# Altium project KlusterLab r2.0.PrjPcb (part 9 of 10)

## Sheet PSU_VCC5V_Buck.SchDoc
size A3; SheetNumber: 3; SheetTotal: 32
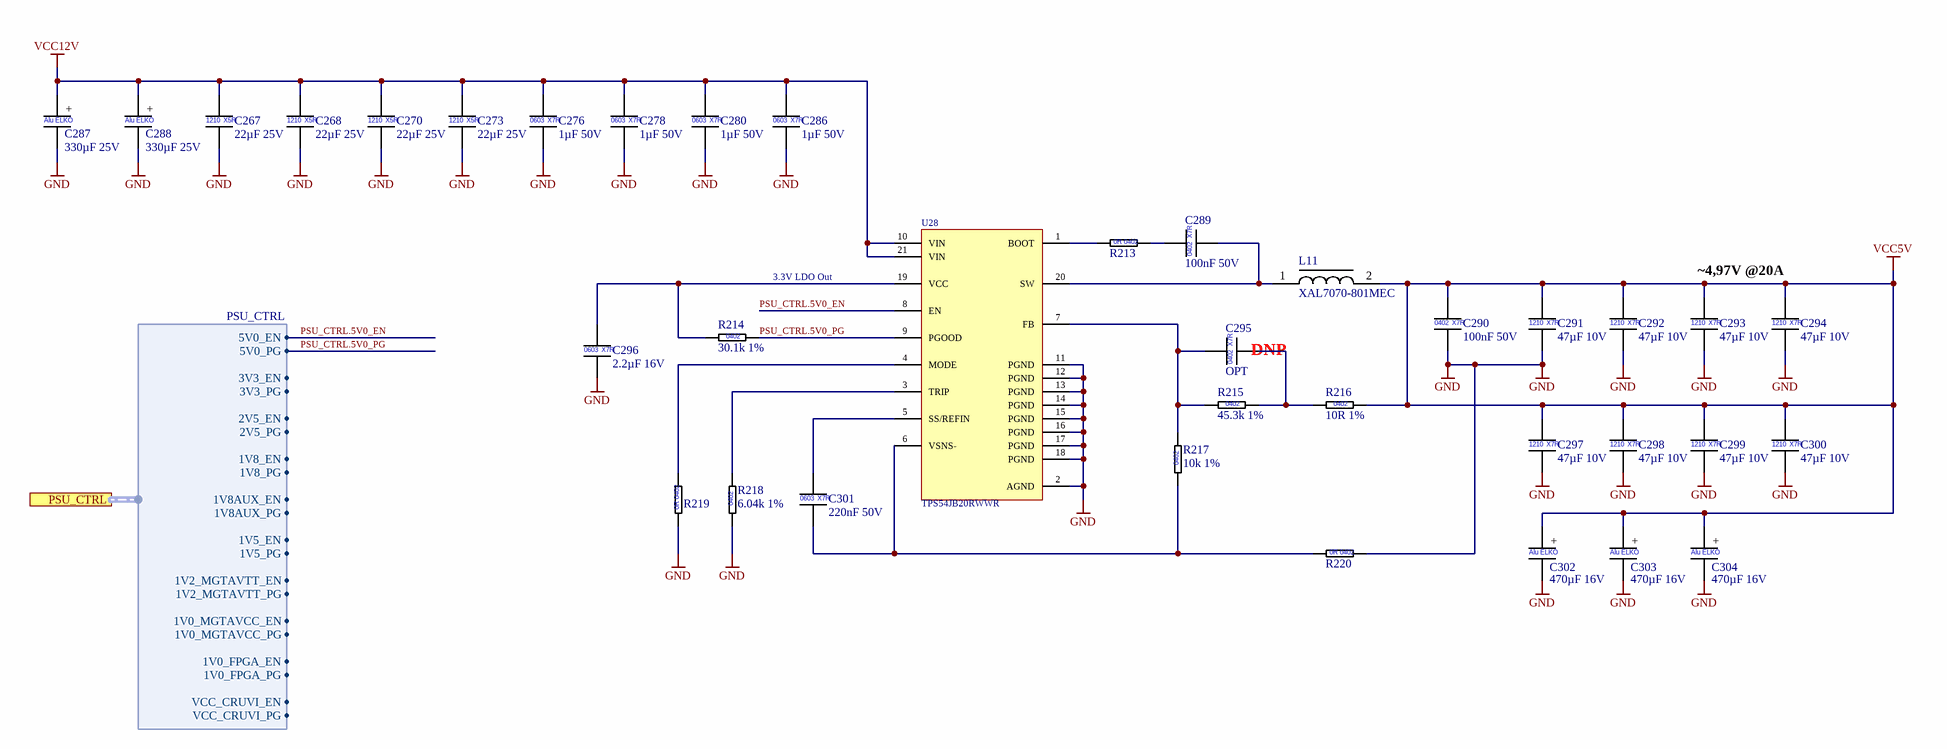
[diagram p26: PSU_VCC5V_Buck.SchDoc]

### Parts
C267  22µF 25V  [CAP_1210]
C268  22µF 25V  [CAP_1210]
C270  22µF 25V  [CAP_1210]
C273  22µF 25V  [CAP_1210]
C276  1µF 50V  [CAP_0603]
C278  1µF 50V  [CAP_0603]
C280  1µF 50V  [CAP_0603]
C286  1µF 50V  [CAP_0603]
C287  330µF 25V  [WCAP-PTG5_D10H12.5]
C288  330µF 25V  [WCAP-PTG5_D10H12.5]
C289  100nF 50V  [CAP_0402]
C290  100nF 50V  [CAP_0402]
C291  47µF 10V  [CAP_1210]
C292  47µF 10V  [CAP_1210]
C293  47µF 10V  [CAP_1210]
C294  47µF 10V  [CAP_1210]
C295  OPT  [CAP_0402]  (no BOM)
C296  2.2µF 16V  [CAP_0603]
C297  47µF 10V  [CAP_1210]
C298  47µF 10V  [CAP_1210]
C299  47µF 10V  [CAP_1210]
C300  47µF 10V  [CAP_1210]
C301  220nF 50V  [CAP_0603]
C302  470µF 16V  [WCAP-PTG5_D8H13]
C303  470µF 16V  [WCAP-PTG5_D8H13]
C304  470µF 16V  [WCAP-PTG5_D8H13]
L11  XAL7070-801MEC  [COILCRAFT_XAL7070]
R213  0R Jumper  [RES_0402]  (value not drawn)
R214  30.1k 1%  [RES_0402]
R215  45.3k 1%  [RES_0402]
R216  10R 1%  [RES_0402]
R217  10k 1%  [RES_0402]
R218  6.04k 1%  [RES_0402]
R219  0R Jumper  [RES_0402]  (value not drawn)
R220  0R Jumper  [RES_0402]  (value not drawn)
U28  TPS54JB20RWWR  [VQFN-HR21_RWW0021A]

### Ports
PSU_CTRL (harness PSU_CTRL, see Power-Tree[2B], PSU_MGTAVCC_Buck[1B], PSU_MGTAVTT_Buck[1B], PSU_VCC1V0_FPGA_Buck[1B], PSU_VCC1V5_Buck[1B], PSU_VCC1V8_Buck[1B], PSU_VCC1V8AUX_Buck[1B], PSU_VCC2V5_Buck[1B], PSU_VCC3V3_Buck[1B], PSU_VCC_CRUVI_ADJ_Buck[1B])

### Harnesses
PSU_CTRL: 5V0_EN, 5V0_PG, 3V3_EN, 3V3_PG, 2V5_EN, 2V5_PG, 1V8_EN, 1V8_PG, 1V8AUX_EN, 1V8AUX_PG, 1V5_EN, 1V5_PG, 1V2_MGTAVTT_EN, 1V2_MGTAVTT_PG, 1V0_MGTAVCC_EN, 1V0_MGTAVCC_PG, 1V0_FPGA_EN, 1V0_FPGA_PG, VCC_CRUVI_EN, VCC_CRUVI_PG

### Nets
GND: C267.2 C268.2 C270.2 C273.2 C276.2 C278.2 C280.2 C286.2 C287.2 C288.2 C290.2 C291.2 C292.2 C293.2 C294.2 C296.2 C297.2 C298.2 C299.2 C300.2 C302.2 C303.2 C304.2 R218.1 R219.1 R220.2 U28.2(AGND) U28.11(PGND) U28.12(PGND) U28.13(PGND) U28.14(PGND) U28.15(PGND) U28.16(PGND) U28.17(PGND) U28.18(PGND)
VCC5V: C290.1 C291.1 C292.1 C293.1 C294.1 C297.1 C298.1 C299.1 C300.1 C302.1 C303.1 C304.1 L11.2 R216.2
VCC12V: C267.1 C268.1 C270.1 C273.1 C276.1 C278.1 C280.1 C286.1 C287.1 C288.1 U28.10(VIN) U28.21(VIN)
PSU_CTRL.5V0_EN: U28.8(EN) ; port PSU_CTRL.5V0_EN
PSU_CTRL.5V0_PG: R214.2 U28.9(PGOOD) ; port PSU_CTRL.5V0_PG
NetC289_1: C289.1 R213.2
NetC289_2: C289.2 L11.1 U28.20(SW)
NetC295_1: C295.1 R215.1 R217.2 U28.7(FB)
NetC295_2: C295.2 R215.2 R216.1
NetC296_1: C296.1 R214.1 U28.19(VCC)
NetC301_1: C301.1 U28.5(SS/REFIN)
NetC301_2: C301.2 R217.1 R220.1 U28.6(VSNS-)
NetR213_1: R213.1 U28.1(BOOT)
NetR218_2: R218.2 U28.3(TRIP)
NetR219_2: R219.2 U28.4(MODE)

### Notes on the sheet
- 3.3V LDO Out
- (near C294) ~4,97V @20A
- (near C295) DNP
- Company:
- Contact:
- Customer:
- mail@pcb-arts.com
- PCB Arts GmbH
- Title:
- Project:
- The  information  contained  in  these  documents  is  confidential,  privileged  and  only  for  the information of the intended recipient and may not be used, published or redistributed Without the prior written consent from PCB Arts GmbH.
- Engineer:
- Document Number:
- Revision:
- Variant:
- Date:
- Time:
- Sheet:
- Status:
- /
- (in symbol CAP_0402_100nF_50V) X7R; 0402
- (in symbol CAP_0402_OPT) X7R; 0402
- (in symbol CAP_0603_1µF_50V_X7R_10%) 0603; X7R
- (in symbol CAP_0603_2.2µF_16V_X7R_10%) 0603; X7R
- (in symbol CAP_0603_220nF_50V_X7R_10%) 0603; X7R
- (in symbol CAP_1210_22µF_25V) 1210; X5R
- (in symbol CAP_1210_47µF_10V_X7R_10%) 1210; X7R
- (in symbol CAP_D8L9_470µF_16V) +; Alu ELKO
- (in symbol CAP_D10L12.5_330µF_25V) +; Alu ELKO
- (in symbol RES_0402_0R Jumper) 0R 0402
- (in symbol RES_0402_6.04k_1%) 0402
- (in symbol RES_0402_10k_1%) 0402
- (in symbol RES_0402_10R_1%) 0402
- (in symbol RES_0402_30.1k_1%) 0402
- (in symbol RES_0402_45.3k_1%) 0402

### Library data of the parts
C267 C268 C270 C273 = CAP_1210_22µF_25V: Multilayer Ceramic Capacitors MLCC - SMD/SMT 1210 25VDC; Manufacturer 1: KEMET; Manufacturer 1 Prt. Nr.: C1210C226K3PACTU; Manufacturer 2 Prt. Nr.: TMK212BBJ226MG-TT; Manufacturer 2: Taiyo Yuden
C276 C278 C280 C286 = CAP_0603_1µF_50V_X7R_10%: Multilayer Ceramic Capacitors MLCC - SMD/SMT 50V 1uF X7R 0603 10%; Manufacturer 1: KYOCERA AVX; Manufacturer 1 Prt. Nr.: 06035C105KAT2A; Manufacturer 2 Prt. Nr.: MSASU168AB7105KTNA01; Manufacturer 2: TAIYO YUDEN
C287 C288 = CAP_D10L12.5_330µF_25V: Organische Polymer-Aluminiumkondensatoren 330uF 25 Volts 20% AEC-Q200; Manufacturer 1: Würth Elektronik; Manufacturer 1 Prt. Nr.: 870025575009
C289 C290 = CAP_0402_100nF_50V: Multilayer Ceramic Capacitors MLCC - SMD/SMT 0402 50VDC; Manufacturer 1: Murata Electronics; Manufacturer 1 Prt. Nr.: GCM155L8EH104KE07D; Manufacturer 2 Prt. Nr.: UMK105B7104KV-FR; Manufacturer 2: TDK
C291-C294 C297-C300 = CAP_1210_47µF_10V_X7R_10%: Multilayer Ceramic Capacitors MLCC - SMD/SMT 47 uF 10 VDC 10% 1210 X7R; Manufacturer 1: Murata Electronics; Manufacturer 1 Prt. Nr.: GRM32ER71A476KE15L; Manufacturer 2 Prt. Nr.: C1210C106K8RACTU; Manufacturer 2: KEMET
C295 = CAP_0402_OPT: Multilayer Ceramic Capacitors MLCC - SMD/SMT 0402 Optional Placeholder
C296 = CAP_0603_2.2µF_16V_X7R_10%: Multilayer Ceramic Capacitors MLCC - SMD/SMT 2.2 uF 16 VDC 10% 0603 X7R; Manufacturer 1: Murata Electronics; Manufacturer 1 Prt. Nr.: GRM188Z71C225KE43D; Manufacturer 2 Prt. Nr.: EMK107BB7225KA-T; Manufacturer 2: TAIYO YUDEN
C301 = CAP_0603_220nF_50V_X7R_10%: Multilayer Ceramic Capacitors MLCC - SMD/SMT 0.22 uF 50 VDC 10% 0603 X7R; Manufacturer 1: Murata Electronics; Manufacturer 1 Prt. Nr.: GRJ188R71H224KE11D; Manufacturer 2 Prt. Nr.: CGA3E3X7R1H224K080AE; Manufacturer 2: TDK
C302-C304 = CAP_D8L9_470µF_16V: Organische Polymer-Aluminiumkondensatoren 470uF 16 Volts 20%; Manufacturer 1: Würth Elektronik; Manufacturer 1 Prt. Nr.: 870025374007
L11 = XAL7070-801MEC_Power Inductors SMD 800nH Shld 20% 25.8A 2.29mOhms AECQ200: Power Inductors - SMD 800nH Shld 20% 25.8A 2.29mOhms AECQ200; Manufacturer 1: Coilcraft; Manufacturer 1 Prt. Nr.: XAL7070-801MEC
R213 R219 R220 = RES_0402_0R Jumper: Thick Film Resistors - SMD 0Ohm; Manufacturer 1: Vishay / Dale; Manufacturer 1 Prt. Nr.: CRCW04020000Z0EDC; Manufacturer 2 Prt. Nr.: RC0402JR-070RL; Manufacturer 2: Yageo
R214 = RES_0402_30.1k_1%: Thick Film Resistors - SMD 30.1kOhm 1%; Manufacturer 1: Vishay / Dale; Manufacturer 1 Prt. Nr.: CRCW040230K1FKEDC; Manufacturer 2 Prt. Nr.: RC0402FR-1330K1L; Manufacturer 2: Yageo
R215 = RES_0402_45.3k_1%: Thick Film Resistors - SMD 45.3kOhm 1%; Manufacturer 1: Vishay / Dale; Manufacturer 1 Prt. Nr.: CRCW040245K3FKEDC; Manufacturer 2 Prt. Nr.: RC0402FR-0745K3L; Manufacturer 2: Yageo
R216 = RES_0402_10R_1%: Thick Film Resistors - SMD 10Ohm 1%; Manufacturer 1: Vishay / Dale; Manufacturer 1 Prt. Nr.: CRCW040210R0FKEE; Manufacturer 2 Prt. Nr.: RC0402FR-7W10RL; Manufacturer 2: Yageo
R217 = RES_0402_10k_1%: Thick Film Resistors - SMD 10kOhm 1%; Manufacturer 1: Vishay / Dale; Manufacturer 1 Prt. Nr.: CRCW040210K0FKEDC; Manufacturer 2 Prt. Nr.: RC0402FR-7W10KL; Manufacturer 2: Yageo
R218 = RES_0402_6.04k_1%: Thick Film Resistors - SMD 6.04kOhm 1%; Manufacturer 1: Vishay / Dale; Manufacturer 1 Prt. Nr.: CRCW04026K04FKEDC; Manufacturer 2 Prt. Nr.: RC0402FR-7W6K04L; Manufacturer 2: Yageo
U28 = TPS54JB20RWWR_Switching Voltage Regulators 2.7-V to 16-V input 20-A synchronous Buck: Switching Voltage Regulators 2.7-V to 16-V input 20-A synchronous Buck; Manufacturer 1: Texas Instruments; Manufacturer 1 Prt. Nr.: TPS54JB20RWWR

## Sheet PSU_VCC_CRUVI_ADJ_Buck.SchDoc
size A3; SheetNumber: 12; SheetTotal: 32
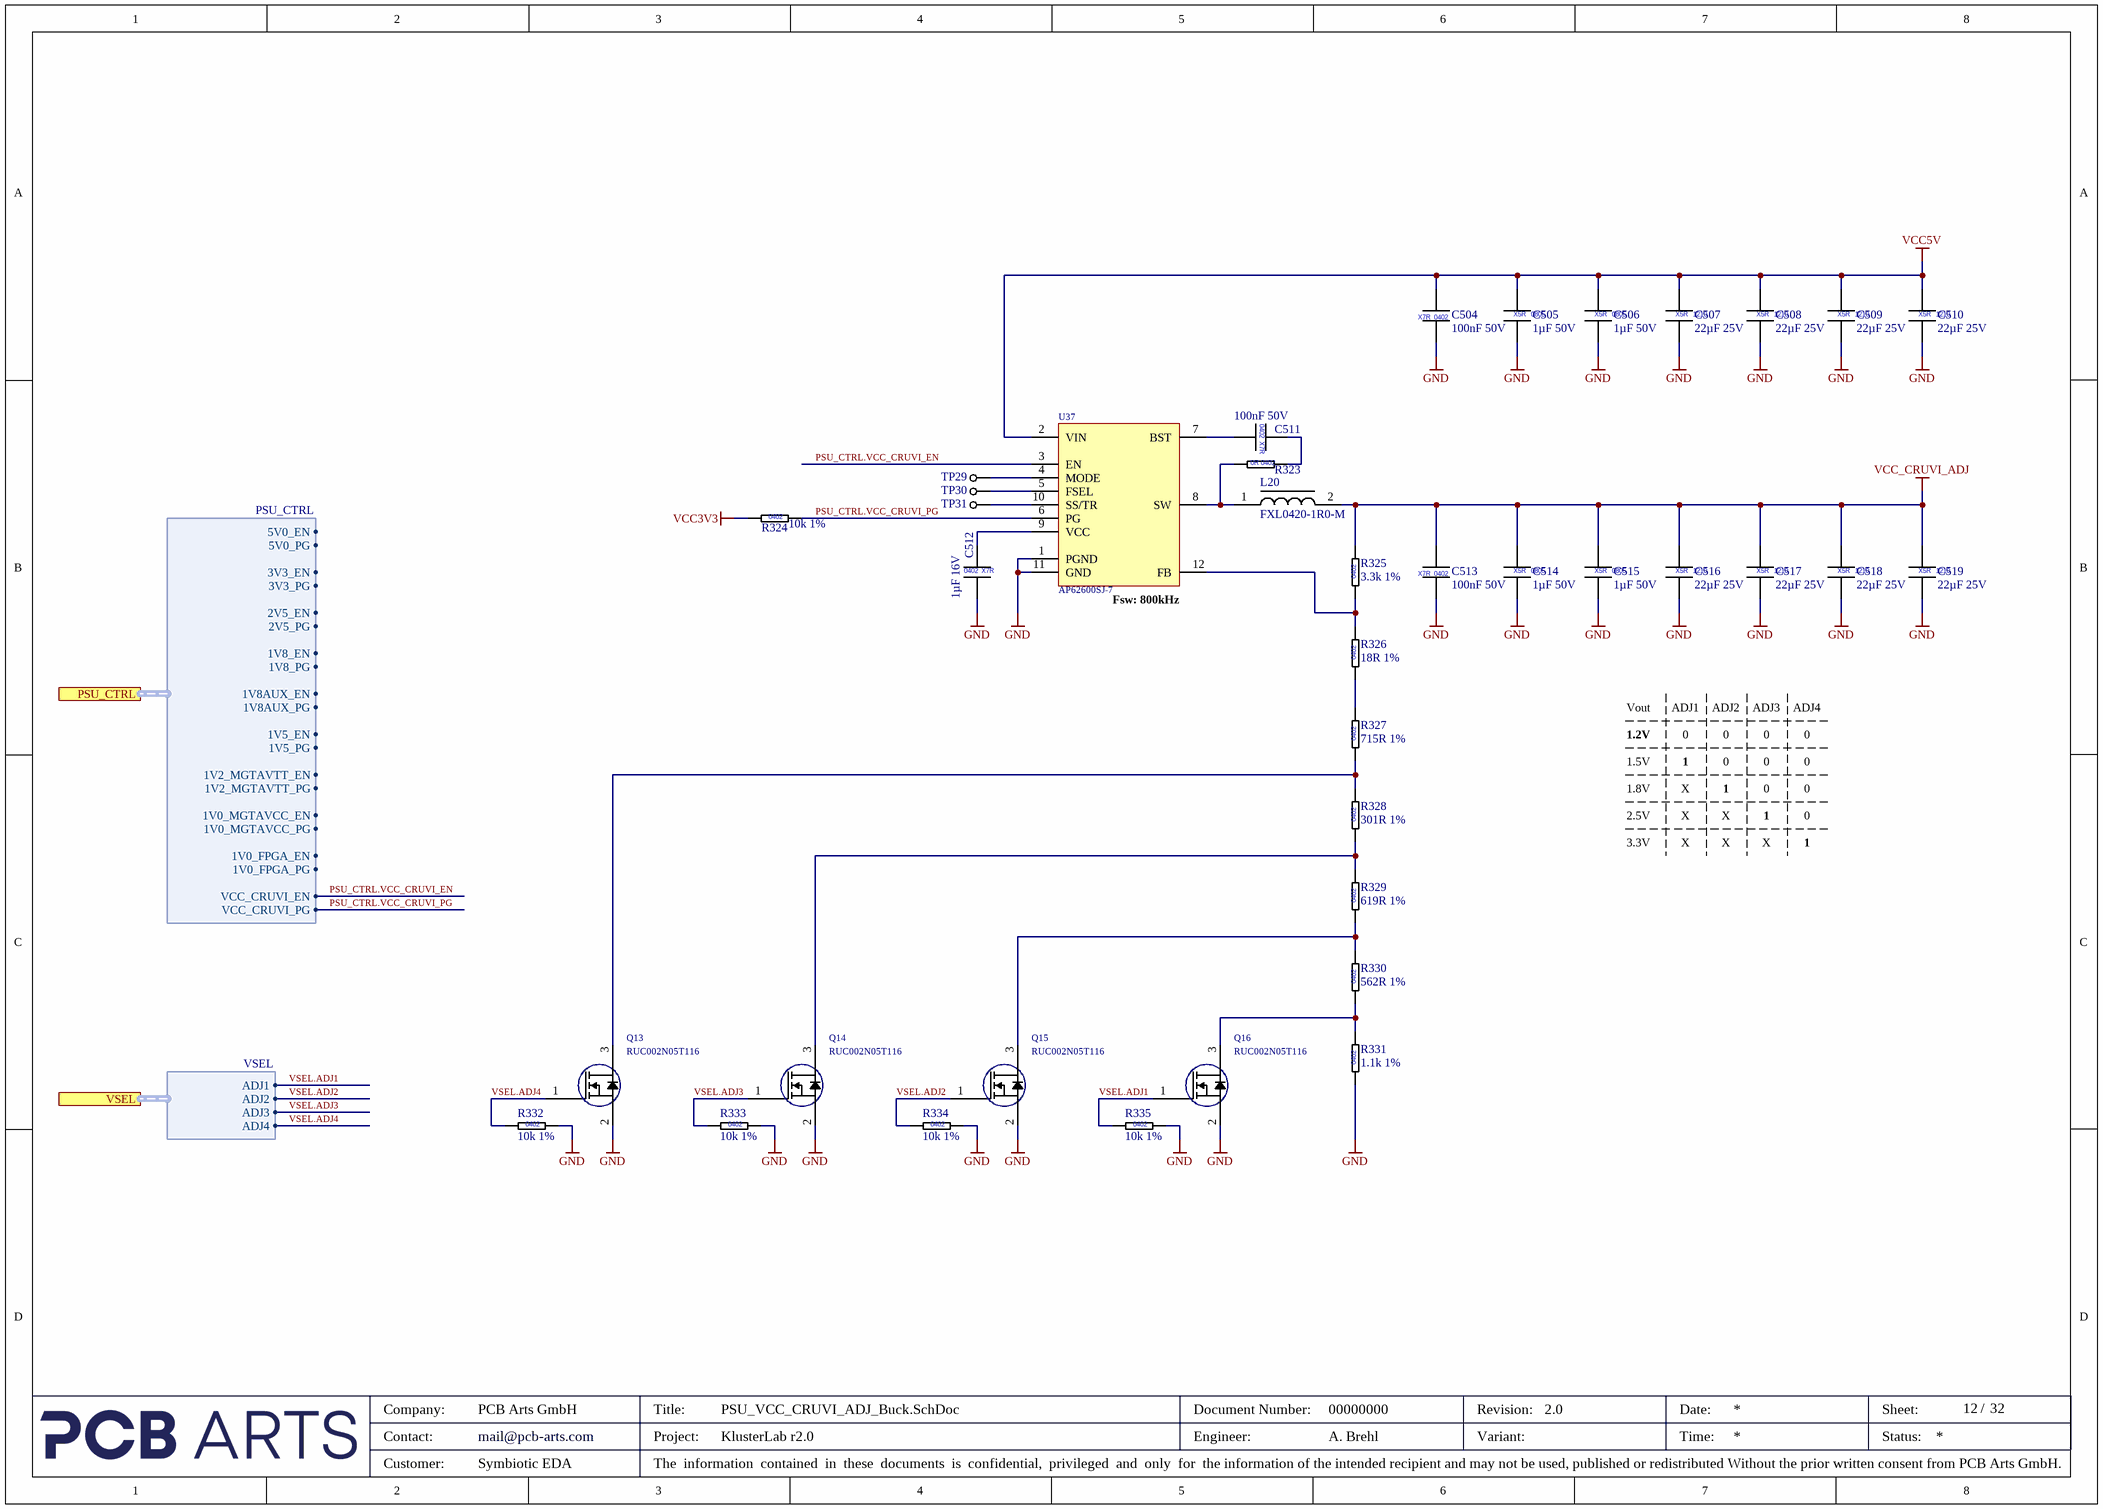
[diagram p27: PSU_VCC_CRUVI_ADJ_Buck.SchDoc]

### Parts
C504  100nF 50V  [CAP_0402_L]
C505  1µF 50V  [CAP_0805]
C506  1µF 50V  [CAP_0805]
C507  22µF 25V  [CAP_1210]
C508  22µF 25V  [CAP_1210]
C509  22µF 25V  [CAP_1210]
C510  22µF 25V  [CAP_1210]
C511  100nF 50V  [CAP_0402_L]
C512  1µF 16V  [CAP_0402_L]
C513  100nF 50V  [CAP_0402_L]
C514  1µF 50V  [CAP_0805]
C515  1µF 50V  [CAP_0805]
C516  22µF 25V  [CAP_1210]
C517  22µF 25V  [CAP_1210]
C518  22µF 25V  [CAP_1210]
C519  22µF 25V  [CAP_1210]
L20  FXL0420-1R0-M  [FXL0420-1R0-M]
Q13  RUC002N05T116  [SOT95P251X112-3N]
Q14  RUC002N05T116  [SOT95P251X112-3N]
Q15  RUC002N05T116  [SOT95P251X112-3N]
Q16  RUC002N05T116  [SOT95P251X112-3N]
R323  0R Jumper  [RES_0402_L]  (value not drawn)
R324  10k 1%  [RES_0402_L]
R325  3.3k 1%  [RES_0402_L]
R326  18R 1%  [RES_0402_L]
R327  715R 1%  [RES_0402_L]
R328  301R 1%  [RES_0402_L]
R329  619R 1%  [RES_0402_L]
R330  562R 1%  [RES_0402_L]
R331  1.1k 1%  [RES_0402_L]
R332  10k 1%  [RES_0402_L]
R333  10k 1%  [RES_0402_L]
R334  10k 1%  [RES_0402_L]
R335  10k 1%  [RES_0402_L]
TP29  Testpoint  [Testpoint 0.8mm]  (value not drawn)  (no BOM)
TP30  Testpoint  [Testpoint 0.8mm]  (value not drawn)  (no BOM)
TP31  Testpoint  [Testpoint 0.8mm]  (value not drawn)  (no BOM)
U37  AP62600SJ-7  [QFN50P200x300x85-12]

### Ports
PSU_CTRL (harness PSU_CTRL, see Power-Tree[2D], PSU_MGTAVCC_Buck[1B], PSU_MGTAVTT_Buck[1B], PSU_VCC1V0_FPGA_Buck[1B], PSU_VCC1V5_Buck[1B], PSU_VCC1V8_Buck[1B], PSU_VCC1V8AUX_Buck[1B], PSU_VCC2V5_Buck[1B], PSU_VCC3V3_Buck[1B], PSU_VCC5V_Buck[1B]), VSEL (harness VSEL, see Power-Tree[2D], Bank 13_Bank 15_Bank 16[8D], Power-Tree[1D])

### Harnesses
PSU_CTRL: 5V0_EN, 5V0_PG, 3V3_EN, 3V3_PG, 2V5_EN, 2V5_PG, 1V8_EN, 1V8_PG, 1V8AUX_EN, 1V8AUX_PG, 1V5_EN, 1V5_PG, 1V2_MGTAVTT_EN, 1V2_MGTAVTT_PG, 1V0_MGTAVCC_EN, 1V0_MGTAVCC_PG, 1V0_FPGA_EN, 1V0_FPGA_PG, VCC_CRUVI_EN, VCC_CRUVI_PG
VSEL: ADJ1, ADJ2, ADJ3, ADJ4

### Nets
GND: C504.1 C505.2 C506.2 C507.2 C508.2 C509.2 C510.2 C512.2 C513.1 C514.2 C515.2 C516.2 C517.2 C518.2 C519.2 Q13.2(D) Q14.2(D) Q15.2(D) Q16.2(D) R331.1 R332.2 R333.2 R334.2 R335.2 U37.1(PGND) U37.11(GND)
VCC3V3: R324.1
VCC5V: C504.2 C505.1 C506.1 C507.1 C508.1 C509.1 C510.1 U37.2(VIN)
VCC_CRUVI_ADJ: C513.2 C514.1 C515.1 C516.1 C517.1 C518.1 C519.1 L20.2 R325.2
PSU_CTRL.VCC_CRUVI_EN: U37.3(EN) ; port PSU_CTRL.VCC_CRUVI_EN
PSU_CTRL.VCC_CRUVI_PG: R324.2 U37.6(PG) ; port PSU_CTRL.VCC_CRUVI_PG
VSEL.ADJ1: Q16.1(G) R335.1 ; port VSEL.ADJ1
VSEL.ADJ2: Q15.1(G) R334.1 ; port VSEL.ADJ2
VSEL.ADJ3: Q14.1(G) R333.1 ; port VSEL.ADJ3
VSEL.ADJ4: Q13.1(G) R332.1 ; port VSEL.ADJ4
NetC511_1: C511.1 R323.2
NetC511_2: C511.2 U37.7(BST)
NetC512_1: C512.1 U37.9(VCC)
NetL20_1: L20.1 R323.1 U37.8(SW)
NetQ13_3: Q13.3(S) R327.1 R328.2
NetQ14_3: Q14.3(S) R328.1 R329.2
NetQ15_3: Q15.3(S) R329.1 R330.2
NetQ16_3: Q16.3(S) R330.1 R331.2
NetR325_1: R325.1 R326.2 U37.12(FB)
NetR326_1: R326.1 R327.2
NetTP29_1: TP29.1(GND) U37.4(MODE)
NetTP30_1: TP30.1(GND) U37.5(FSEL)
NetTP31_1: TP31.1(GND) U37.10(SS/TR)

### Notes on the sheet
- (near U37) Fsw: 800kHz
- Vout
- ADJ1
- ADJ2
- ADJ3
- ADJ4
- 1.2V
- 1.5V
- 1.8V
- 1
- X
- 0
- 2.5V
- 3.3V
- Company:
- Contact:
- Customer:
- mail@pcb-arts.com
- PCB Arts GmbH
- Title:
- Project:
- The  information  contained  in  these  documents  is  confidential,  privileged  and  only  for  the information of the intended recipient and may not be used, published or redistributed Without the prior written consent from PCB Arts GmbH.
- Engineer:
- Document Number:
- Revision:
- Variant:
- Date:
- Time:
- Sheet:
- Status:
- /
- (in symbol CAP_0402_1µF_16V) 0402; X7R
- (in symbol CAP_0402_100nF_50V) 0402; X7R
- (in symbol CAP_0805_1µF_50V) X5R; 0805
- (in symbol CAP_1210_22µF_25V) X5R; 1210
- (in symbol RES_0402_0R Jumper) 0R 0402
- (in symbol RES_0402_1.1k_1%) 0402
- (in symbol RES_0402_3.3k_1%) 0402
- (in symbol RES_0402_10k_1%) 0402
- (in symbol RES_0402_18R_1%) 0402
- (in symbol RES_0402_301R_1%) 0402
- (in symbol RES_0402_562R_1%) 0402
- (in symbol RES_0402_619R_1%) 0402
- (in symbol RES_0402_715R_1%) 0402

### Library data of the parts
C504 C511 C513 = CAP_0402_100nF_50V: as C289 on sheet PSU_VCC5V_Buck; Manufacturer 2: TDK
C505 C506 C514 C515 = CAP_0805_1µF_50V: Multilayer Ceramic Capacitors MLCC - SMD/SMT 0805 50VDC; Manufacturer 1: Samsung Electro-Mechanics; Manufacturer 1 Prt. Nr.: CL21B105KBFNNNG; Manufacturer 2 Prt. Nr.: UMK212BJ105KGHT; Manufacturer 2: Taiyo Yuden
C507-C510 C516-C519 = CAP_1210_22µF_25V: as C267 on sheet PSU_VCC5V_Buck; Manufacturer 2: Taiyo Yuden
C512 = CAP_0402_1µF_16V: Multilayer Ceramic Capacitors MLCC - SMD/SMT 0402 16VDC; Manufacturer 1: Taiyo Yuden; Manufacturer 1 Prt. Nr.: EMK105BJ105MVHF; Manufacturer 2 Prt. Nr.: GRM155R61E105KA12D; Manufacturer 2: Murata Electronics
L20 = 1uH 6A 27mΩ  FXL0420-1R0-M: 1uH ±20% 6A 27mΩ SMD,4.4x4.5x1.8mm Power Inductor; Manufacturer 1: cjiang(Changjiang Microelectronics Tech); Manufacturer 1 Prt. Nr.: FXL0420-1R0-M
Q13-Q16 = RUC002N05T116_MOSFET N-Ch 1.2 VGS Spec: MOSFET N-Ch 1.2 VGS Spec; Manufacturer 1: ROHM Semiconductor; Manufacturer 1 Prt. Nr.: RUC002N05T116
R323 = RES_0402_0R Jumper: as R213 on sheet PSU_VCC5V_Buck; Manufacturer 2: Yageo
R324 R332-R335 = RES_0402_10k_1%: as R217 on sheet PSU_VCC5V_Buck; Manufacturer 2: Yageo
R325 = RES_0402_3.3k_1%: Thick Film Resistors - SMD 3.3kOhm 1%; Manufacturer 1: Vishay / Dale; Manufacturer 1 Prt. Nr.: CRCW04023K30FKEDC; Manufacturer 2 Prt. Nr.: RC0402FR-133K3L; Manufacturer 2: Yageo
R326 = RES_0402_18R_1%: Thick Film Resistors - SMD 18Ohm 1%; Manufacturer 1: Vishay / Dale; Manufacturer 1 Prt. Nr.: CRCW040218R0FKEDC; Manufacturer 2 Prt. Nr.: RC0402FR-7W18RL; Manufacturer 2: Yageo
R327 = RES_0402_715R_1%: Thick Film Resistors - SMD 715Ohm 1%; Manufacturer 1: Vishay / Dale; Manufacturer 1 Prt. Nr.: CRCW0402715RFKED; Manufacturer 2 Prt. Nr.: RC0402FR-07715RL; Manufacturer 2: Yageo
R328 = RES_0402_301R_1%: Thick Film Resistors - SMD 301Ohm 1%; Manufacturer 1: Vishay / Dale; Manufacturer 1 Prt. Nr.: CRCW0402301RFKED; Manufacturer 2 Prt. Nr.: RC0402FR-07301RL; Manufacturer 2: Yageo
R329 = RES_0402_619R_1%: Thick Film Resistors - SMD 619Ohm 1%; Manufacturer 1: Vishay / Dale; Manufacturer 1 Prt. Nr.: CRCW0402619RFKED; Manufacturer 2 Prt. Nr.: RC0402FR-07619RL; Manufacturer 2: Yageo
R330 = RES_0402_562R_1%: Thick Film Resistors - SMD 562Ohm 1%; Manufacturer 1: Vishay / Dale; Manufacturer 1 Prt. Nr.: CRCW0402562RFKED; Manufacturer 2 Prt. Nr.: RC0402FR-07562RL; Manufacturer 2: Yageo
R331 = RES_0402_1.1k_1%: Thick Film Resistors - SMD 1.1kOhm 1%; Manufacturer 1: Vishay / Dale; Manufacturer 1 Prt. Nr.: CRCW04021K10FKED; Manufacturer 2 Prt. Nr.: RC0402FR-071K1L; Manufacturer 2: Yageo
TP29-TP31 = Testpoint 0.8mm
U37 = AP62600SJ-7_4.5V TO 18V INPUT, 6A SYNCHRONOUS BUCK CONVERTER: 4.5V TO 18V INPUT, 6A SYNCHRONOUS BUCK CONVERTER; Manufacturer 1: Diodes Incorporated; Manufacturer 1 Prt. Nr.: AP62600SJ-7

## Sheet Cruvi Pinheader.SchDoc
size A3; SheetNumber: 27; SheetTotal: 32
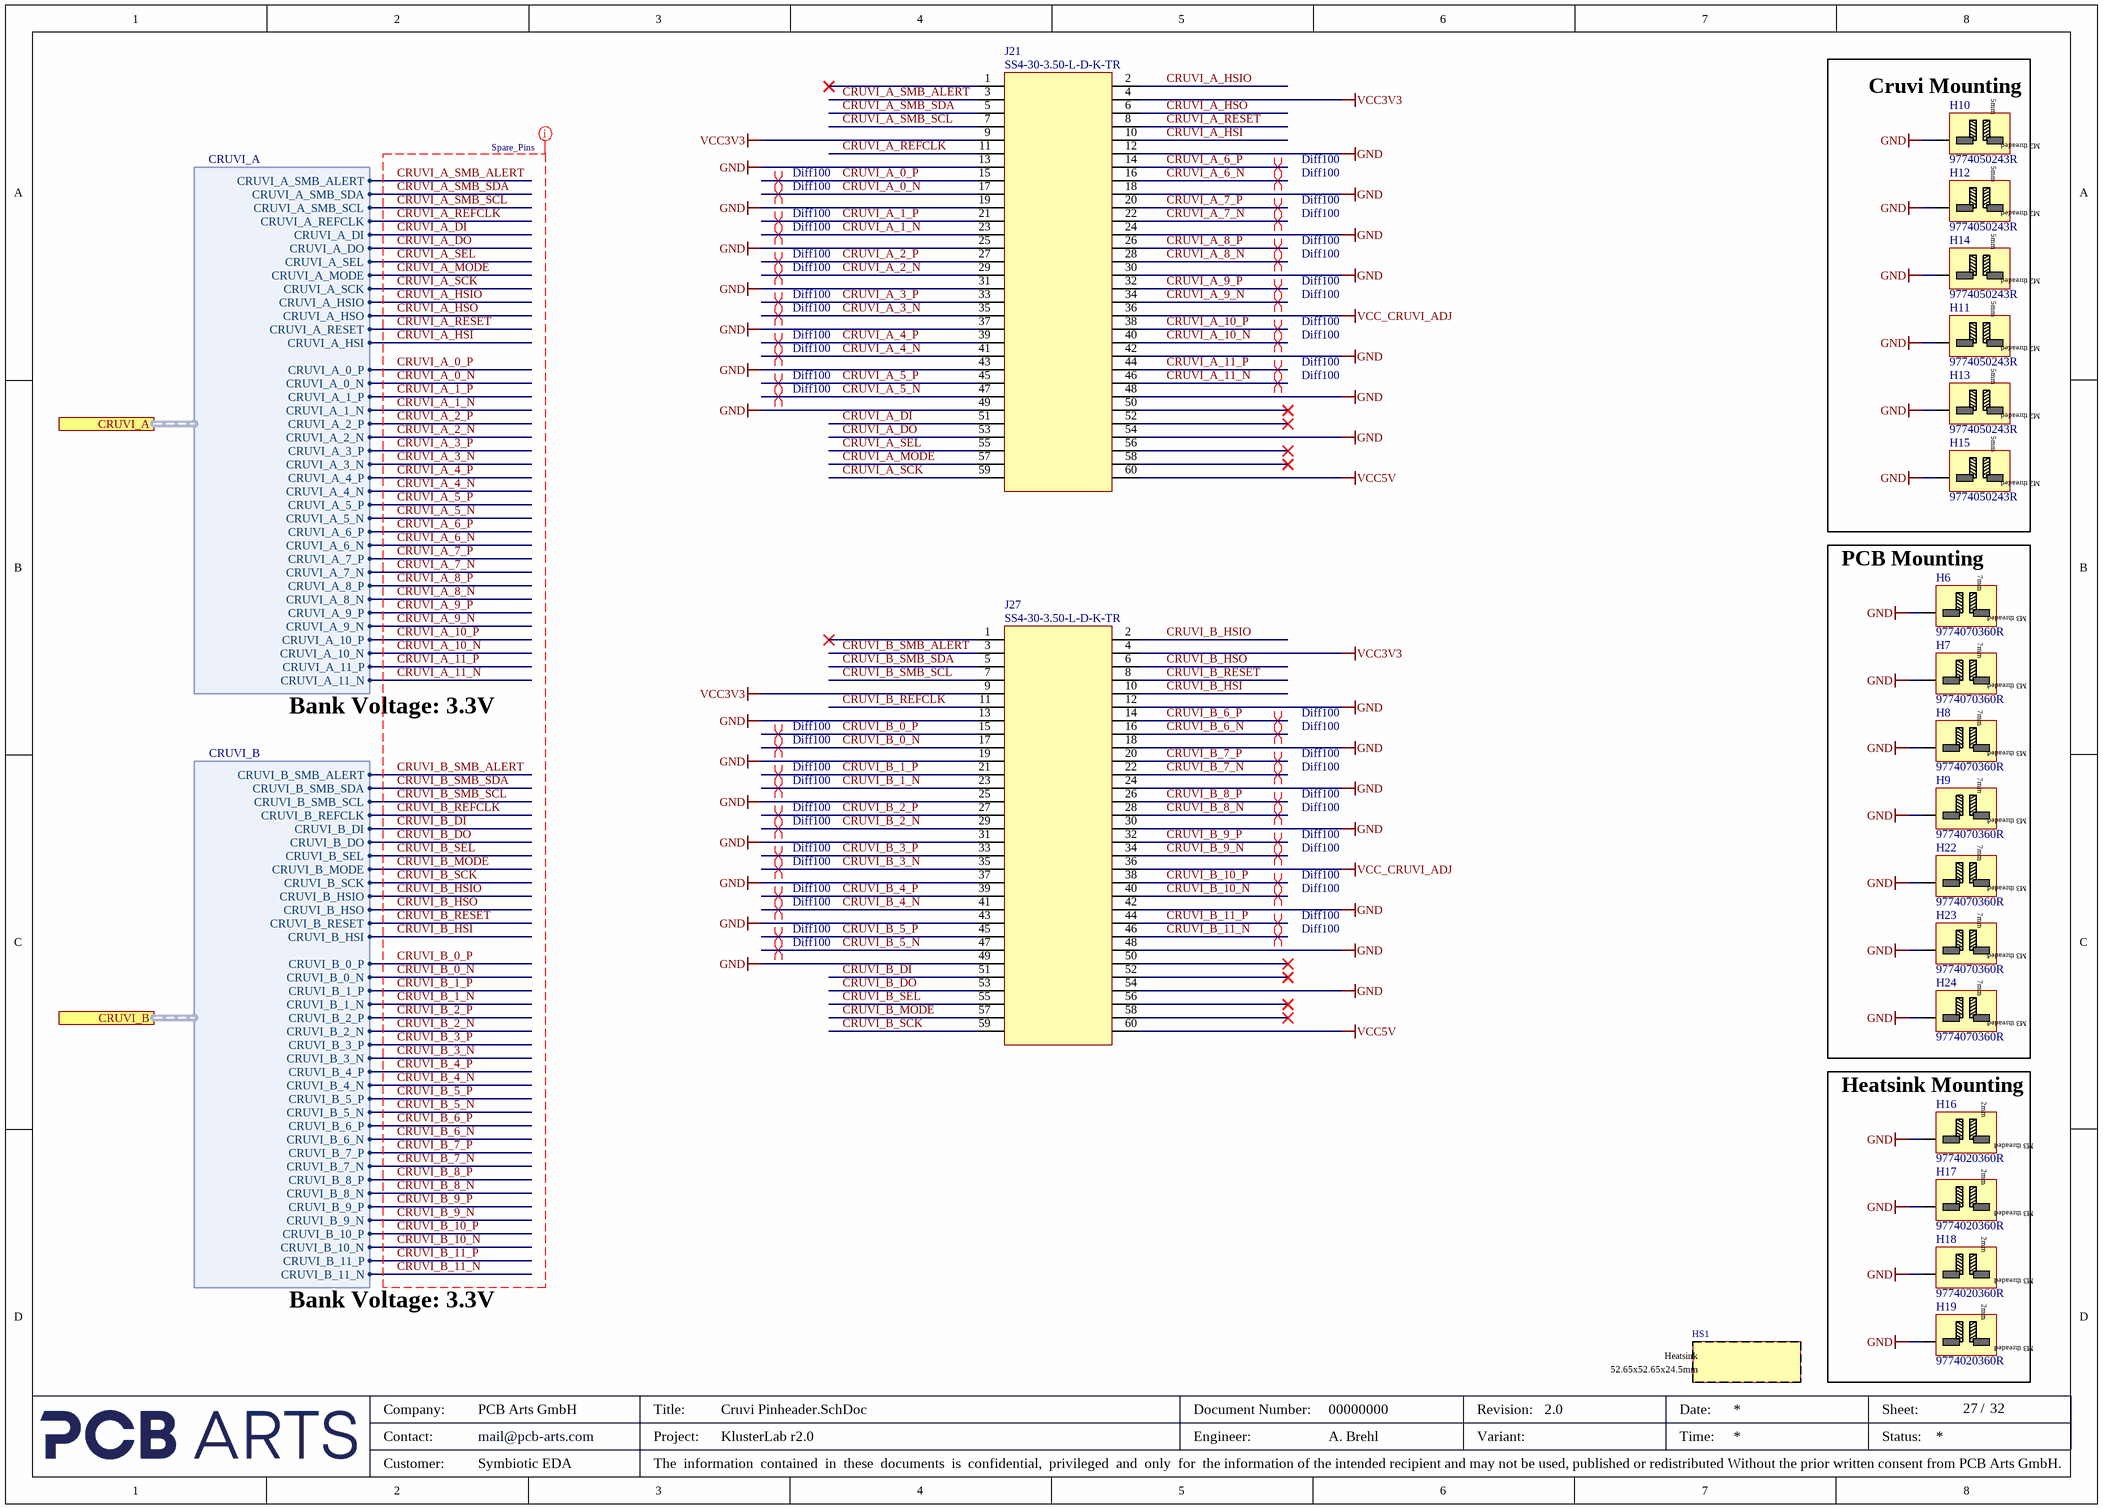
[diagram p28: Cruvi Pinheader.SchDoc]

### Parts
H6  9774070360R  [9774070360R]
H7  9774070360R  [9774070360R]
H8  9774070360R  [9774070360R]
H9  9774070360R  [9774070360R]
H10  9774050243R  [9774050243R]
H11  9774050243R  [9774050243R]
H12  9774050243R  [9774050243R]
H13  9774050243R  [9774050243R]
H14  9774050243R  [9774050243R]
H15  9774050243R  [9774050243R]
H16  9774020360R  [9774020360R]
H17  9774020360R  [9774020360R]
H18  9774020360R  [9774020360R]
H19  9774020360R  [9774020360R]
H22  9774070360R  [9774070360R]
H23  9774070360R  [9774070360R]
H24  9774070360R  [9774070360R]
HS1  Heatsink Assembly 52.65x52.65x24.5mm  [ATS-61500W-C2-R0]  (value not drawn)
J21  SS4-30-3.50-L-D-K-TR  [SS4-30-3.50-L-D-K-TR]
J27  SS4-30-3.50-L-D-K-TR  [SS4-30-3.50-L-D-K-TR]

### Blocks framed on the sheet
Cruvi Mounting: H10-H15
PCB Mounting: H6-H9 H22-H24
Heatsink Mounting: H16-H19

### Ports
CRUVI_A (harness CRUVI_A, see Top-Level-Sheet[3C], Bank 13_Bank 15_Bank 16[1C]), CRUVI_B (harness CRUVI_B, see Top-Level-Sheet[3C], Bank 13_Bank 15_Bank 16[3C])

### Harnesses
CRUVI_A: CRUVI_A_SMB_ALERT, CRUVI_A_SMB_SDA, CRUVI_A_SMB_SCL, CRUVI_A_REFCLK, CRUVI_A_DI, CRUVI_A_DO, CRUVI_A_SEL, CRUVI_A_MODE, CRUVI_A_SCK, CRUVI_A_HSIO, CRUVI_A_HSO, CRUVI_A_RESET, CRUVI_A_HSI, CRUVI_A_0_P, CRUVI_A_0_N, CRUVI_A_1_P, CRUVI_A_1_N, CRUVI_A_2_P, CRUVI_A_2_N, CRUVI_A_3_P, CRUVI_A_3_N, CRUVI_A_4_P, CRUVI_A_4_N, CRUVI_A_5_P, CRUVI_A_5_N, CRUVI_A_6_P, CRUVI_A_6_N, CRUVI_A_7_P, CRUVI_A_7_N, CRUVI_A_8_P, CRUVI_A_8_N, CRUVI_A_9_P, CRUVI_A_9_N, CRUVI_A_10_P, CRUVI_A_10_N, CRUVI_A_11_P, CRUVI_A_11_N
CRUVI_B: CRUVI_B_SMB_ALERT, CRUVI_B_SMB_SDA, CRUVI_B_SMB_SCL, CRUVI_B_REFCLK, CRUVI_B_DI, CRUVI_B_DO, CRUVI_B_SEL, CRUVI_B_MODE, CRUVI_B_SCK, CRUVI_B_HSIO, CRUVI_B_HSO, CRUVI_B_RESET, CRUVI_B_HSI, CRUVI_B_0_P, CRUVI_B_0_N, CRUVI_B_1_P, CRUVI_B_1_N, CRUVI_B_2_P, CRUVI_B_2_N, CRUVI_B_3_P, CRUVI_B_3_N, CRUVI_B_4_P, CRUVI_B_4_N, CRUVI_B_5_P, CRUVI_B_5_N, CRUVI_B_6_P, CRUVI_B_6_N, CRUVI_B_7_P, CRUVI_B_7_N, CRUVI_B_8_P, CRUVI_B_8_N, CRUVI_B_9_P, CRUVI_B_9_N, CRUVI_B_10_P, CRUVI_B_10_N, CRUVI_B_11_P, CRUVI_B_11_N

### Nets
GND: H6.1 H7.1 H8.1 H9.1 H10.1 H11.1 H12.1 H13.1 H14.1 H15.1 H16.1 H17.1 H18.1 H19.1 H22.1 H23.1 H24.1 J21.12 J21.13 J21.18 J21.19 J21.24 J21.25 J21.30 J21.31 J21.37 J21.42 J21.43 J21.48 J21.49 J21.54 J27.12 J27.13 J27.18 J27.19 J27.24 J27.25 J27.30 J27.31 J27.37 J27.42 J27.43 J27.48 J27.49 J27.54
VCC3V3: J21.4 J21.9 J27.4 J27.9
VCC5V: J21.60 J27.60
VCC_CRUVI_ADJ: J21.36 J27.36
CRUVI_A_0_N: J21.17 ; port CRUVI_A.CRUVI_A_0_N
CRUVI_A_0_P: J21.15 ; port CRUVI_A.CRUVI_A_0_P
CRUVI_A_1_N: J21.23 ; port CRUVI_A.CRUVI_A_1_N
CRUVI_A_1_P: J21.21 ; port CRUVI_A.CRUVI_A_1_P
CRUVI_A_2_N: J21.29 ; port CRUVI_A.CRUVI_A_2_N
CRUVI_A_2_P: J21.27 ; port CRUVI_A.CRUVI_A_2_P
CRUVI_A_3_N: J21.35 ; port CRUVI_A.CRUVI_A_3_N
CRUVI_A_3_P: J21.33 ; port CRUVI_A.CRUVI_A_3_P
CRUVI_A_4_N: J21.41 ; port CRUVI_A.CRUVI_A_4_N
CRUVI_A_4_P: J21.39 ; port CRUVI_A.CRUVI_A_4_P
CRUVI_A_5_N: J21.47 ; port CRUVI_A.CRUVI_A_5_N
CRUVI_A_5_P: J21.45 ; port CRUVI_A.CRUVI_A_5_P
CRUVI_A_6_N: J21.16 ; port CRUVI_A.CRUVI_A_6_N
CRUVI_A_6_P: J21.14 ; port CRUVI_A.CRUVI_A_6_P
CRUVI_A_7_N: J21.22 ; port CRUVI_A.CRUVI_A_7_N
CRUVI_A_7_P: J21.20 ; port CRUVI_A.CRUVI_A_7_P
CRUVI_A_8_N: J21.28 ; port CRUVI_A.CRUVI_A_8_N
CRUVI_A_8_P: J21.26 ; port CRUVI_A.CRUVI_A_8_P
CRUVI_A_9_N: J21.34 ; port CRUVI_A.CRUVI_A_9_N
CRUVI_A_9_P: J21.32 ; port CRUVI_A.CRUVI_A_9_P
CRUVI_A_10_N: J21.40 ; port CRUVI_A.CRUVI_A_10_N
CRUVI_A_10_P: J21.38 ; port CRUVI_A.CRUVI_A_10_P
CRUVI_A_11_N: J21.46 ; port CRUVI_A.CRUVI_A_11_N
CRUVI_A_11_P: J21.44 ; port CRUVI_A.CRUVI_A_11_P
CRUVI_A_DI: J21.51 ; port CRUVI_A.CRUVI_A_DI
CRUVI_A_DO: J21.53 ; port CRUVI_A.CRUVI_A_DO
CRUVI_A_HSI: J21.10 ; port CRUVI_A.CRUVI_A_HSI
CRUVI_A_HSIO: J21.2 ; port CRUVI_A.CRUVI_A_HSIO
CRUVI_A_HSO: J21.6 ; port CRUVI_A.CRUVI_A_HSO
CRUVI_A_MODE: J21.57 ; port CRUVI_A.CRUVI_A_MODE
CRUVI_A_REFCLK: J21.11 ; port CRUVI_A.CRUVI_A_REFCLK
CRUVI_A_RESET: J21.8 ; port CRUVI_A.CRUVI_A_RESET
CRUVI_A_SCK: J21.59 ; port CRUVI_A.CRUVI_A_SCK
CRUVI_A_SEL: J21.55 ; port CRUVI_A.CRUVI_A_SEL
CRUVI_A_SMB_ALERT: J21.3 ; port CRUVI_A.CRUVI_A_SMB_ALERT
CRUVI_A_SMB_SCL: J21.7 ; port CRUVI_A.CRUVI_A_SMB_SCL
CRUVI_A_SMB_SDA: J21.5 ; port CRUVI_A.CRUVI_A_SMB_SDA
CRUVI_B_0_N: J27.17 ; port CRUVI_B.CRUVI_B_0_N
CRUVI_B_0_P: J27.15 ; port CRUVI_B.CRUVI_B_0_P
CRUVI_B_1_N: J27.23 ; port CRUVI_B.CRUVI_B_1_N
CRUVI_B_1_P: J27.21 ; port CRUVI_B.CRUVI_B_1_P
CRUVI_B_2_N: J27.29 ; port CRUVI_B.CRUVI_B_2_N
CRUVI_B_2_P: J27.27 ; port CRUVI_B.CRUVI_B_2_P
CRUVI_B_3_N: J27.35 ; port CRUVI_B.CRUVI_B_3_N
CRUVI_B_3_P: J27.33 ; port CRUVI_B.CRUVI_B_3_P
CRUVI_B_4_N: J27.41 ; port CRUVI_B.CRUVI_B_4_N
CRUVI_B_4_P: J27.39 ; port CRUVI_B.CRUVI_B_4_P
CRUVI_B_5_N: J27.47 ; port CRUVI_B.CRUVI_B_5_N
CRUVI_B_5_P: J27.45 ; port CRUVI_B.CRUVI_B_5_P
CRUVI_B_6_N: J27.16 ; port CRUVI_B.CRUVI_B_6_N
CRUVI_B_6_P: J27.14 ; port CRUVI_B.CRUVI_B_6_P
CRUVI_B_7_N: J27.22 ; port CRUVI_B.CRUVI_B_7_N
CRUVI_B_7_P: J27.20 ; port CRUVI_B.CRUVI_B_7_P
CRUVI_B_8_N: J27.28 ; port CRUVI_B.CRUVI_B_8_N
CRUVI_B_8_P: J27.26 ; port CRUVI_B.CRUVI_B_8_P
CRUVI_B_9_N: J27.34 ; port CRUVI_B.CRUVI_B_9_N
CRUVI_B_9_P: J27.32 ; port CRUVI_B.CRUVI_B_9_P
CRUVI_B_10_N: J27.40 ; port CRUVI_B.CRUVI_B_10_N
CRUVI_B_10_P: J27.38 ; port CRUVI_B.CRUVI_B_10_P
CRUVI_B_11_N: J27.46 ; port CRUVI_B.CRUVI_B_11_N
CRUVI_B_11_P: J27.44 ; port CRUVI_B.CRUVI_B_11_P
CRUVI_B_DI: J27.51 ; port CRUVI_B.CRUVI_B_DI
CRUVI_B_DO: J27.53 ; port CRUVI_B.CRUVI_B_DO
CRUVI_B_HSI: J27.10 ; port CRUVI_B.CRUVI_B_HSI
CRUVI_B_HSIO: J27.2 ; port CRUVI_B.CRUVI_B_HSIO
CRUVI_B_HSO: J27.6 ; port CRUVI_B.CRUVI_B_HSO
CRUVI_B_MODE: J27.57 ; port CRUVI_B.CRUVI_B_MODE
CRUVI_B_REFCLK: J27.11 ; port CRUVI_B.CRUVI_B_REFCLK
CRUVI_B_RESET: J27.8 ; port CRUVI_B.CRUVI_B_RESET
CRUVI_B_SCK: J27.59 ; port CRUVI_B.CRUVI_B_SCK
CRUVI_B_SEL: J27.55 ; port CRUVI_B.CRUVI_B_SEL
CRUVI_B_SMB_ALERT: J27.3 ; port CRUVI_B.CRUVI_B_SMB_ALERT
CRUVI_B_SMB_SCL: J27.7 ; port CRUVI_B.CRUVI_B_SMB_SCL
CRUVI_B_SMB_SDA: J27.5 ; port CRUVI_B.CRUVI_B_SMB_SDA

Not connected (* = marked no-connect by the designer): J21 1* 50* 52* 56* 58*; J27 1* 50* 52* 56* 58*

### Layout directives
net class Spare_Pins: CRUVI_A_0_N, CRUVI_A_0_P, CRUVI_A_1_N, CRUVI_A_1_P, CRUVI_A_2_N, CRUVI_A_2_P, CRUVI_A_3_N, CRUVI_A_3_P, CRUVI_A_4_N, CRUVI_A_4_P, CRUVI_A_5_N, CRUVI_A_5_P, CRUVI_A_6_N, CRUVI_A_6_P, CRUVI_A_7_N, CRUVI_A_7_P, CRUVI_A_8_N, CRUVI_A_8_P, CRUVI_A_9_N, CRUVI_A_9_P, CRUVI_A_10_N, CRUVI_A_10_P, CRUVI_A_11_N, CRUVI_A_11_P, CRUVI_A_DI, CRUVI_A_DO, CRUVI_A_HSI, CRUVI_A_HSIO, CRUVI_A_HSO, CRUVI_A_MODE, CRUVI_A_REFCLK, CRUVI_A_RESET, CRUVI_A_SCK, CRUVI_A_SEL, CRUVI_A_SMB_ALERT, CRUVI_A_SMB_SCL, CRUVI_A_SMB_SDA, CRUVI_B_0_N, CRUVI_B_0_P, CRUVI_B_1_N, CRUVI_B_1_P, CRUVI_B_2_N, CRUVI_B_2_P, CRUVI_B_3_N, CRUVI_B_3_P, CRUVI_B_4_N, CRUVI_B_4_P, CRUVI_B_5_N, CRUVI_B_5_P, CRUVI_B_6_N, CRUVI_B_6_P, CRUVI_B_7_N, CRUVI_B_7_P, CRUVI_B_8_N, CRUVI_B_8_P, CRUVI_B_9_N, CRUVI_B_9_P, CRUVI_B_10_N, CRUVI_B_10_P, CRUVI_B_11_N, CRUVI_B_11_P, CRUVI_B_DI, CRUVI_B_DO, CRUVI_B_HSI, CRUVI_B_HSIO, CRUVI_B_HSO, CRUVI_B_MODE, CRUVI_B_REFCLK, CRUVI_B_RESET, CRUVI_B_SCK, CRUVI_B_SEL, CRUVI_B_SMB_ALERT, CRUVI_B_SMB_SCL, CRUVI_B_SMB_SDA
differential pair; net class Diff100: CRUVI_A_0_N, CRUVI_A_0_P, CRUVI_A_1_N, CRUVI_A_1_P, CRUVI_A_2_N, CRUVI_A_2_P, CRUVI_A_3_N, CRUVI_A_3_P, CRUVI_A_4_N, CRUVI_A_4_P, CRUVI_A_5_N, CRUVI_A_5_P, CRUVI_A_6_N, CRUVI_A_6_P, CRUVI_A_7_N, CRUVI_A_7_P, CRUVI_A_8_N, CRUVI_A_8_P, CRUVI_A_9_N, CRUVI_A_9_P, CRUVI_A_10_N, CRUVI_A_10_P, CRUVI_A_11_N, CRUVI_A_11_P, CRUVI_B_0_N, CRUVI_B_0_P, CRUVI_B_1_N, CRUVI_B_1_P, CRUVI_B_2_N, CRUVI_B_2_P, CRUVI_B_3_N, CRUVI_B_3_P, CRUVI_B_4_N, CRUVI_B_4_P, CRUVI_B_5_N, CRUVI_B_5_P, CRUVI_B_6_N, CRUVI_B_6_P, CRUVI_B_7_N, CRUVI_B_7_P, CRUVI_B_8_N, CRUVI_B_8_P, CRUVI_B_9_N, CRUVI_B_9_P, CRUVI_B_10_N, CRUVI_B_10_P, CRUVI_B_11_N, CRUVI_B_11_P

### Notes on the sheet
- Bank Voltage: 3.3V
- Company:
- Contact:
- Customer:
- mail@pcb-arts.com
- PCB Arts GmbH
- Title:
- Project:
- The  information  contained  in  these  documents  is  confidential,  privileged  and  only  for  the information of the intended recipient and may not be used, published or redistributed Without the prior written consent from PCB Arts GmbH.
- Engineer:
- Document Number:
- Revision:
- Variant:
- Date:
- Time:
- Sheet:
- Status:
- /
- (in symbol ATS-61500W-C2-R0_Heatsink Assembly 52.65x52.65x24.5mm) Heatsink; 52.65x52.65x24.5mm
- (in symbol Würth Standoff M2 h:5mm) 5mm; M2 threaded
- (in symbol Würth Standoff M3 h:2mm) 2mm; M3 threaded
- (in symbol Würth Standoff M3 h:7mm) 7mm; M3 threaded

### Library data of the parts
H6-H9 H22-H24 = Würth Standoff M3 h:7mm: Würth Standoff M3 h:7mm 9774070360R; Manufacturer 1: Würth Elektronik; Manufacturer 1 Prt. Nr.: 9774070360R
H10-H15 = Würth Standoff M2 h:5mm: Würth Standoff M2 h:5mm 9774050243R; Manufacturer 1: Würth Elektronik; Manufacturer 1 Prt. Nr.: 9774050243R
H16-H19 = Würth Standoff M3 h:2mm: Würth Standoff M3 h:2mm 9774020360R; Manufacturer 1: Würth Elektronik; Manufacturer 1 Prt. Nr.: 9774020360R
HS1 = ATS-61500W-C2-R0_Heatsink Assembly 52.65x52.65x24.5mm: Machined Copper Heatsink for GaN Devices; Manufacturer 1: Advanced Thermal Solutions; Manufacturer 1 Prt. Nr.: ATS-61500W-C2-R0
J21 J27 = SS4-30-3.50-L-D-K-TR: Platine-zu-Platine & Mezzanine-Steckverbinder 0.40 mm Micro Blade & Beam Ultra Fine Pitch Socket; Manufacturer 1: Samtec; Manufacturer 1 Prt. Nr.: SS4-30-3.50-L-D-K-TR

## Sheet Memory-SD_UHS_II.SchDoc
size A3; SheetNumber: 32; SheetTotal: 32
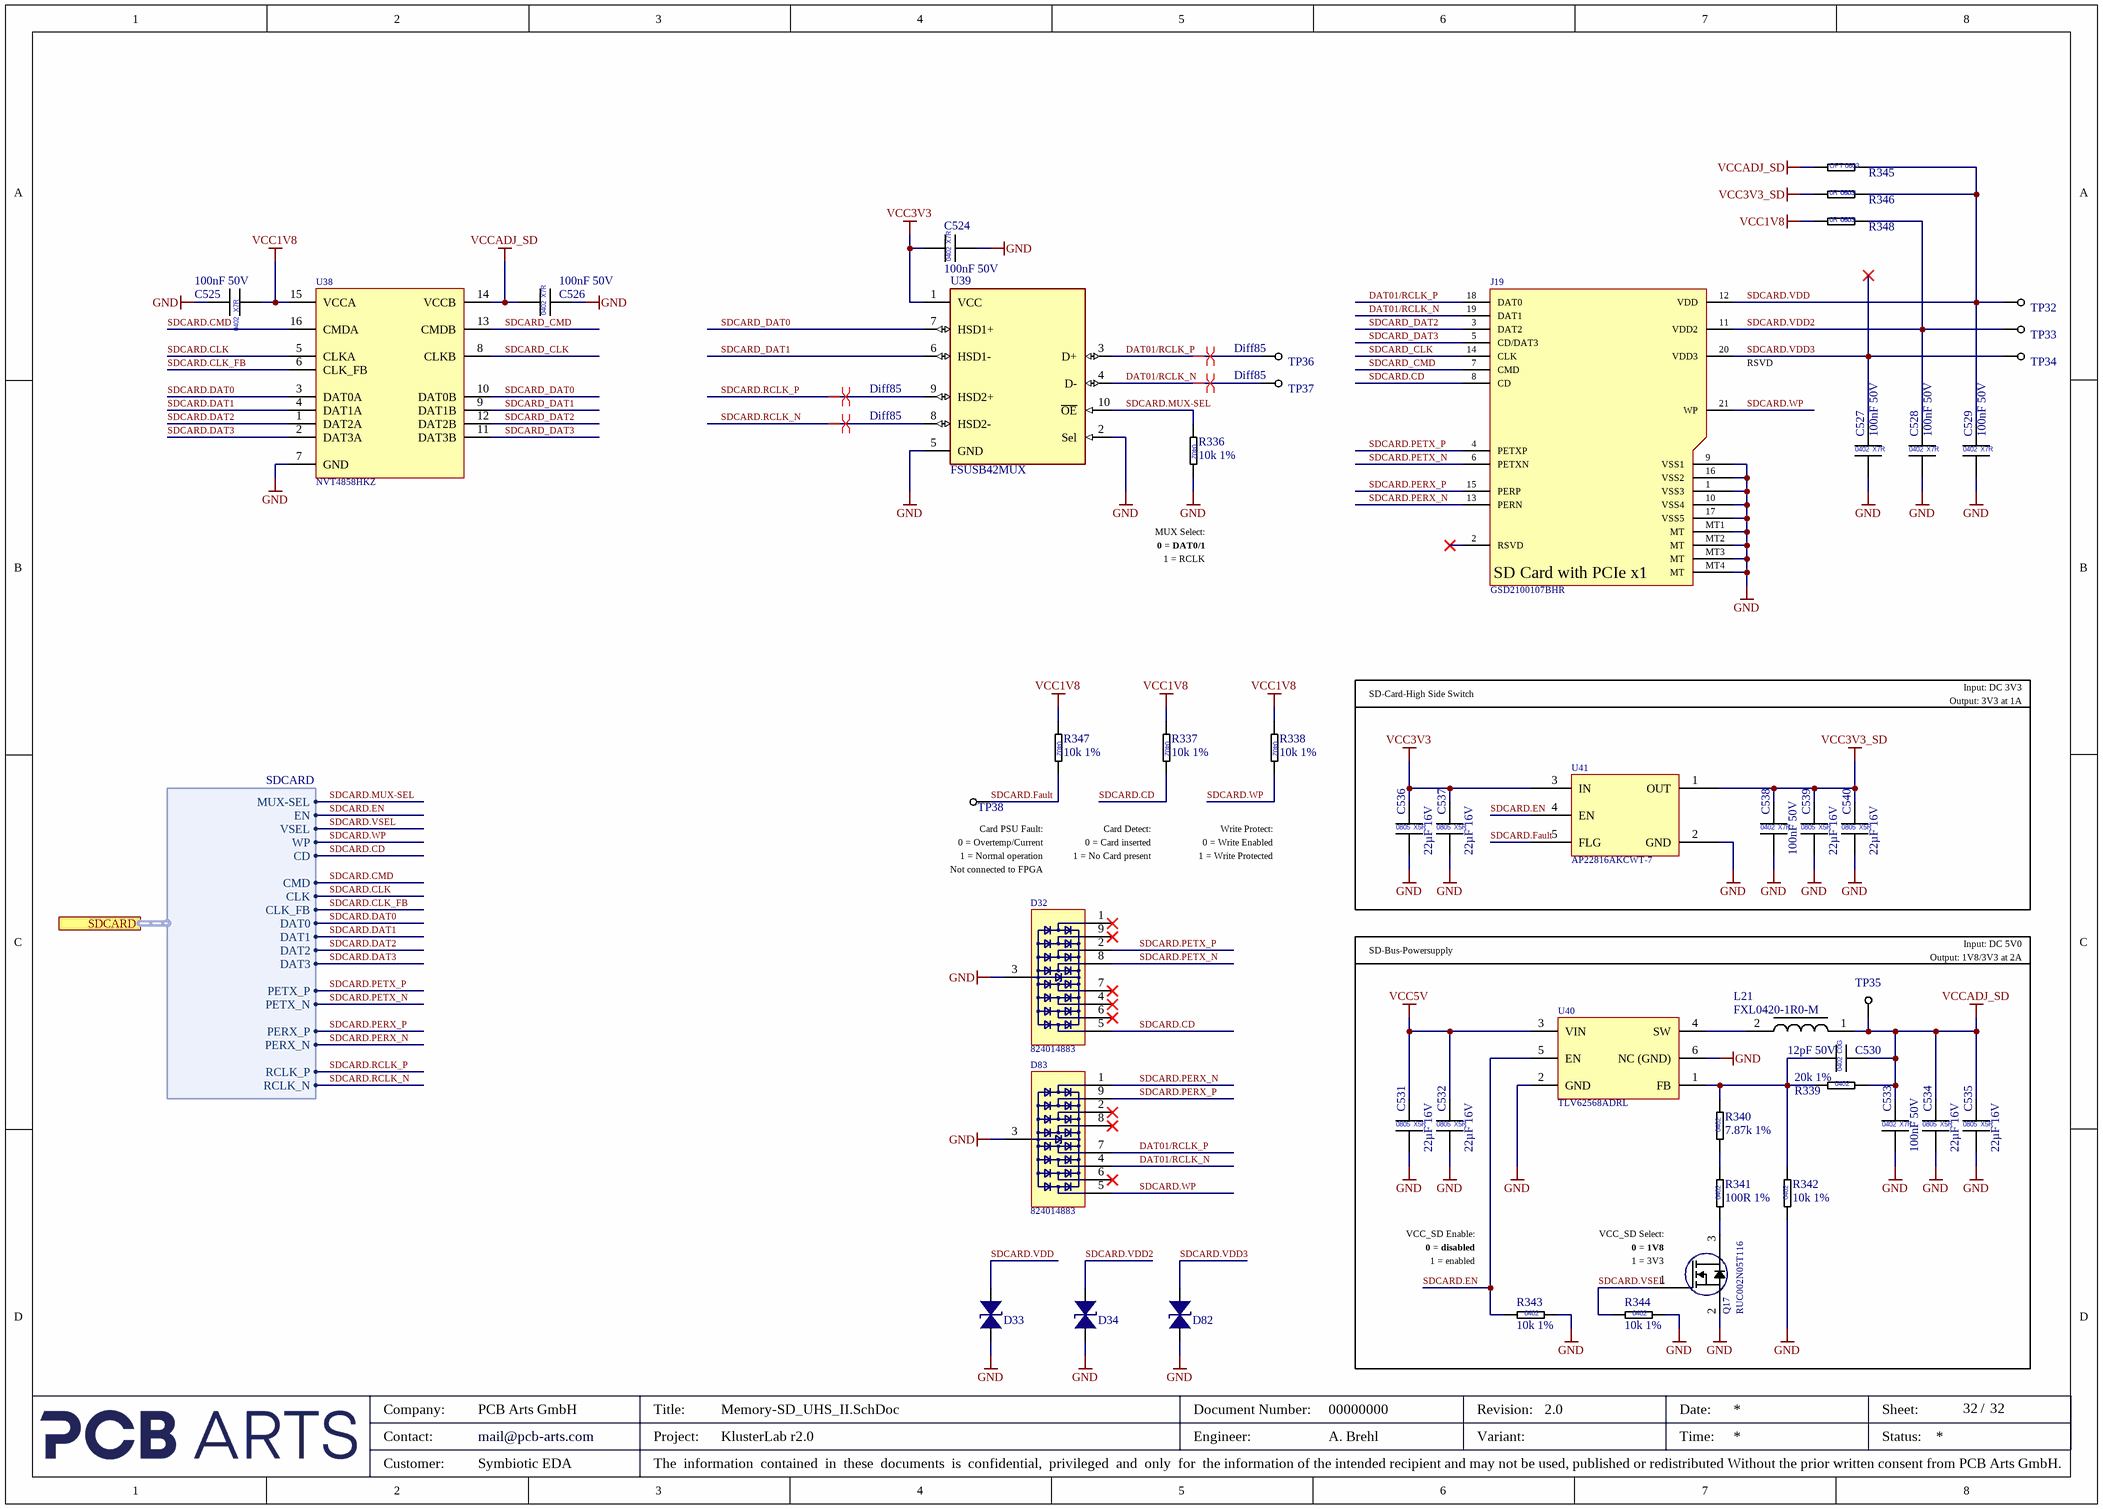
[diagram p29: Memory-SD_UHS_II.SchDoc]

### Parts
C524  100nF 50V  [CAP_0402_L]
C525  100nF 50V  [CAP_0402_L]
C526  100nF 50V  [CAP_0402_L]
C527  100nF 50V  [CAP_0402_L]
C528  100nF 50V  [CAP_0402_L]
C529  100nF 50V  [CAP_0402_L]
C530  12pF 50V  [CAP_0402_L]
C531  22µF 16V  [CAP_0805]
C532  22µF 16V  [CAP_0805]
C533  100nF 50V  [CAP_0402_L]
C534  22µF 16V  [CAP_0805]
C535  22µF 16V  [CAP_0805]
C536  22µF 16V  [CAP_0805]
C537  22µF 16V  [CAP_0805]
C538  100nF 50V  [CAP_0402_L]
C539  22µF 16V  [CAP_0805]
C540  22µF 16V  [CAP_0805]
D32  824014883  [WE-TVS-DFN3810-9L]
D33  CESDP0402UC5VB  [TVS_0402]  (value not drawn)
D34  CESDP0402UC5VB  [TVS_0402]  (value not drawn)
D82  CESDP0402UC5VB  [TVS_0402]  (value not drawn)
D83  824014883  [WE-TVS-DFN3810-9L]
J19  Symbol Text: GSD2100107BHR  [Amphenol_GSD2100107BHR]  (hidden comment: Amphenol / GSD2100107BHR / SD-Card UHS-II / Side Entry / Push-Push)
L21  FXL0420-1R0-M  [FXL0420-1R0-M]
Q17  RUC002N05T116  [SOT95P251X112-3N]
R336  10k 1%  [RES_0402_L]
R337  10k 1%  [RES_0402_L]
R338  10k 1%  [RES_0402_L]
R339  20k 1%  [RES_0402_L]
R340  7.87k 1%  [RES_0402_L]
R341  100R 1%  [RES_0402_L]
R342  10k 1%  [RES_0402_L]
R343  10k 1%  [RES_0402_L]
R344  10k 1%  [RES_0402_L]
R345  OPT  [RES_0603_L]  (value not drawn)  (no BOM)
R346  0R Jumper  [RES_0603_L]  (value not drawn)
R347  10k 1%  [RES_0402_L]
R348  0R Jumper  [RES_0603_L]  (value not drawn)
TP32  Testpoint  [Testpoint 0.8mm]  (value not drawn)  (no BOM)
TP33  Testpoint  [Testpoint 0.8mm]  (value not drawn)  (no BOM)
TP34  Testpoint  [Testpoint 0.8mm]  (value not drawn)  (no BOM)
TP35  Testpoint  [Testpoint 0.8mm]  (value not drawn)  (no BOM)
TP36  Testpoint  [Testpoint 0.8mm]  (value not drawn)  (no BOM)
TP37  Testpoint  [Testpoint 0.8mm]  (value not drawn)  (no BOM)
TP38  Testpoint  [Testpoint 0.8mm]  (value not drawn)  (no BOM)
U38  NVT4858HKZ  [QFN40P180X260X55-16N]
U39  FSUSB42MUX  [SOP50P300X300X110-10N]
U40  TLV62568ADRL  [SON50P150X80-6N]
U41  AP22816AKCWT-7  [SOT95P285X140-5N]

### Ports
SDCARD (harness SDCARD, see Top-Level-Sheet[3B], MGT Banks 115-116[8B], SMI Bank 12[1B])

### Harnesses
SDCARD: MUX-SEL, EN, VSEL, WP, CD, CMD, CLK, CLK_FB, PETX_P, PETX_N, DAT0, DAT1, DAT2, DAT3, PERX_P, PERX_N, RCLK_P, RCLK_N

### Nets
GND: C524.2 C525.2 C526.2 C527.2 C528.2 C529.2 C531.2 C532.2 C533.2 C534.2 C535.2 C536.2 C537.2 C538.2 C539.2 C540.2 D32.3(GND) D33.2 D34.2 D82.2 D83.3(GND) J19.1(VSS3) J19.9(VSS1) J19.10(VSS4) J19.16(VSS2) J19.17(VSS5) J19.MT1(MT) J19.MT2(MT) J19.MT3(MT) J19.MT4(MT) Q17.2(D) R336.2 R342.1 R343.2 R344.2 U38.7(GND) U39.2(Sel) U39.5(GND) U40.2(GND) U40.6(NC_(GND)) U41.2(GND)
VCC1V8: C525.1 R337.1 R338.1 R347.1 R348.1 U38.15(VCCA)
VCC3V3: C524.1 C536.1 C537.1 U39.1(VCC) U41.3(IN)
VCC3V3_SD: C538.1 C539.1 C540.1 R346.1 U41.1(OUT)
VCC5V: C531.1 C532.1 U40.3(VIN)
VCCADJ_SD: C526.1 C530.2 C533.1 C534.1 C535.1 L21.1 R339.2 R345.1 TP35.1(GND) U38.14(VCCB)
DAT01/RCLK_N: D83.4(IO3) J19.19(DAT1) TP37.1(GND) U39.4(D-)
DAT01/RCLK_P: D83.7(IO6) J19.18(DAT0) TP36.1(GND) U39.3(D+)
SDCARD.CD: D32.5(IO4) J19.8(CD) R337.2 ; port SDCARD.CD
SDCARD.CLK: U38.5(CLKA) ; port SDCARD.CLK
SDCARD.CLK_FB: U38.6(CLK_FB) ; port SDCARD.CLK_FB
SDCARD.CMD: U38.16(CMDA) ; port SDCARD.CMD
SDCARD.DAT0: U38.3(DAT0A) ; port SDCARD.DAT0
SDCARD.DAT1: U38.4(DAT1A) ; port SDCARD.DAT1
SDCARD.DAT2: U38.1(DAT2A) ; port SDCARD.DAT2
SDCARD.DAT3: U38.2(DAT3A) ; port SDCARD.DAT3
SDCARD.EN: R343.1 U40.5(EN) U41.4(EN) ; port SDCARD.EN
SDCARD.Fault: R347.2 TP38.1(GND) U41.5(FLG)
SDCARD.MUX-SEL: R336.1 U39.10(~{OE}) ; port SDCARD.MUX-SEL
SDCARD.PERX_N: D83.1(IO1) J19.13(PERN) ; port SDCARD.PERX_N
SDCARD.PERX_P: D83.9(IO8) J19.15(PERP) ; port SDCARD.PERX_P
SDCARD.PETX_N: D32.8(IO7) J19.6(PETXN) ; port SDCARD.PETX_N
SDCARD.PETX_P: D32.2(IO2) J19.4(PETXP) ; port SDCARD.PETX_P
SDCARD.RCLK_N: U39.8(HSD2-) ; port SDCARD.RCLK_N
SDCARD.RCLK_P: U39.9(HSD2+) ; port SDCARD.RCLK_P
SDCARD.VDD: C529.1 D33.1 J19.12(VDD) R345.2 R346.2 TP32.1(GND)
SDCARD.VDD2: C528.1 D34.1 J19.11(VDD2) R348.2 TP33.1(GND)
SDCARD.VDD3: C527.1 D82.1 J19.20(VDD3) TP34.1(GND)
SDCARD.VSEL: Q17.1(G) R344.1 ; port SDCARD.VSEL
SDCARD.WP: D83.5(IO4) J19.21(WP) R338.2 ; port SDCARD.WP
SDCARD_CLK: J19.14(CLK) U38.8(CLKB)
SDCARD_CMD: J19.7(CMD) U38.13(CMDB)
SDCARD_DAT0: U38.10(DAT0B) U39.7(HSD1+)
SDCARD_DAT1: U38.9(DAT1B) U39.6(HSD1-)
SDCARD_DAT2: J19.3(DAT2) U38.12(DAT2B)
SDCARD_DAT3: J19.5(CD/DAT3) U38.11(DAT3B)
NetC530_1: C530.1 R339.1 R340.2 R342.2 U40.1(FB)
NetL21_2: L21.2 U40.4(SW)
NetQ17_3: Q17.3(S) R341.1
NetR340_1: R340.1 R341.2

Not connected (* = marked no-connect by the designer): D32 1(IO1)* 4(IO3)* 6(IO5)* 7(IO6)* 9(IO8)*; D83 2(IO2)* 6(IO5)* 8(IO7)*; J19 2(RSVD)*

### Layout directives
differential pair; net class Diff85: DAT01/RCLK_N, DAT01/RCLK_P, SDCARD.RCLK_N, SDCARD.RCLK_P

### Notes on the sheet
- (near J19) RSVD
- MUX Select:
- 1 = RCLK
- 0 = DAT0/1
- SD-Card-High Side Switch
- Input: DC 3V3
- Output: 3V3 at 1A
- (near TP38) Card PSU Fault:
- 1 = Normal operation
- (near TP38) 0 = Overtemp/Current
- Card Detect:
- 1 = No Card present
- 0 = Card inserted
- Write Protect:
- 1 = Write Protected
- 0 = Write Enabled
- Not connected to FPGA
- SD-Bus-Powersupply
- Input: DC 5V0
- Output: 1V8/3V3 at 2A
- VCC_SD Enable:
- 1 = enabled
- 0 = disabled
- (near Q17) VCC_SD Select:
- (near Q17) 1 = 3V3
- (near Q17) 0 = 1V8
- Company:
- Contact:
- Customer:
- mail@pcb-arts.com
- PCB Arts GmbH
- Title:
- Project:
- The  information  contained  in  these  documents  is  confidential,  privileged  and  only  for  the information of the intended recipient and may not be used, published or redistributed Without the prior written consent from PCB Arts GmbH.
- Engineer:
- Document Number:
- Revision:
- Variant:
- Date:
- Time:
- Sheet:
- Status:
- /
- (in symbol CAP_0402_12pF_50V) C0G; 0402
- (in symbol CAP_0402_100nF_50V) 0402; X7R
- (in symbol CAP_0805_22µF_16V) 0805; X5R
- (in symbol CMP-CON-000076-3) SD Card with PCIe x1
- (in symbol RES_0402_7.87k_1%) 0402
- (in symbol RES_0402_10k_1%) 0402
- (in symbol RES_0402_20k_1%) 0402
- (in symbol RES_0402_100R_1%) 0402
- (in symbol RES_0603_0R_Jumper_1) 0R; 0603
- (in symbol RES_0603_OPT) OPT 0603

### Library data of the parts
C524-C529 C533 C538 = CAP_0402_100nF_50V: as C289 on sheet PSU_VCC5V_Buck; Manufacturer 2: TDK
C530 = CAP_0402_12pF_50V: Multilayer Ceramic Capacitors MLCC - SMD/SMT 0402 50VDC; Manufacturer 1: Murata Electronics; Manufacturer 1 Prt. Nr.: GCM1555C1H120JA16J; Manufacturer 2 Prt. Nr.: C0402C120J5GACTU; Manufacturer 2: KEMET
C531 C532 C534-C537 C539 C540 = CAP_0805_22µF_16V: Multilayer Ceramic Capacitors MLCC - SMD/SMT 0805 16VDC; Manufacturer 1: Samsung Electro-Mechanics; Manufacturer 1 Prt. Nr.: CL21A226KOQNNNG; Manufacturer 2 Prt. Nr.: GRM21BC81C226ME44K; Manufacturer 2: Murata Electronics
D32 D83 = 824014883_ESD-Suppressors_TVS-Diodes_3.3V_0.5pF_8Chnl: ESD Suppressors / TVS Diodes WE-TVS Diode Array 3.3V 0.5pF 8Channel; Manufacturer 1: Wurth Elektronik; Manufacturer 1 Prt. Nr.: 824014883
D33 D34 D82 = CESDP0402UC5VB_TVS Diode 0402: Low Capacitance ESD Protection Diode 0402; Manufacturer 1: CREATEK; Manufacturer 2 Prt. Nr.: BPESD0402-05ST; Manufacturer 1 Prt. Nr.: CESDP0402UC5VB; Manufacturer 2: BORN
J19 = CMP-CON-000076-3: Horizontal SD Card UHS-II Connector with PCIe x1 Pins, Push-Push operation; Gender: Female; Manufacturer 1 Prt. Nr.: GSD2100107BHR; Manufacturer 1: Amphenol; Value: GSD2100107BHR; Entry Direction: Side Entry; Mount: Surface Mount; Pin Count: 19; Min Operating Temperature: -40°C; Max Operating Temperature: 85°C
L21 = 1uH 6A 27mΩ  FXL0420-1R0-M: as L20 on sheet PSU_VCC_CRUVI_ADJ_Buck; Manufacturer 1 Prt. Nr.: FXL0420-1R0-M
Q17 = RUC002N05T116_MOSFET N-Ch 1.2 VGS Spec: as Q13-Q16 on sheet PSU_VCC_CRUVI_ADJ_Buck; Manufacturer 1 Prt. Nr.: RUC002N05T116
R336-R338 R342-R344 R347 = RES_0402_10k_1%: as R217 on sheet PSU_VCC5V_Buck; Manufacturer 2: Yageo
R339 = RES_0402_20k_1%: Thick Film Resistors - SMD 20kOhm 1%; Manufacturer 1: Vishay / Dale; Manufacturer 1 Prt. Nr.: CRCW040220K0FKEDC; Manufacturer 2 Prt. Nr.: RC0402FR-7D20KL; Manufacturer 2: Yageo
R340 = RES_0402_7.87k_1%: Thick Film Resistors - SMD 7.87kOhm 1%; Manufacturer 1: Panasonic; Manufacturer 1 Prt. Nr.: ERJ-2RKF7871X; Manufacturer 2 Prt. Nr.: RC0402FR-077K87L; Manufacturer 2: Yageo
R341 = RES_0402_100R_1%: Thick Film Resistors - SMD 100Ohm 1%; Manufacturer 1: Vishay / Dale; Manufacturer 1 Prt. Nr.: CRCW0402100RFKEE; Manufacturer 2 Prt. Nr.: RC0402FR-7W100RL; Manufacturer 2: Yageo
R345 = RES_0603_OPT: Thick Film Resistors - SMD Optional
R346 R348 = RES_0603_0R_Jumper_1: Thick Film Resistors - SMD 0Ohm Jumper; Manufacturer 1: Yageo; Manufacturer 1 Prt. Nr.: RC0603JR-100RL; Manufacturer 2 Prt. Nr.: CRCW06030000Z0EBC; Manufacturer 2: Vishay / Draloric
TP32-TP38 = Testpoint 0.8mm
U38 = NVT4858HKZ_Levelshifter SD 3.0-SDR104, auto-direction, EMI filter and ESD protection: Levelshifter SD 3.0-SDR104, auto-direction, EMI filter and ESD protection; Manufacturer 1: NXP Semiconductors; Manufacturer 1 Prt. Nr.: NVT4858HKZ
U39 = FSUSB42MUX_IC USB SWITCH DPDT: IC USB SWITCH DPDT; Manufacturer 1: onsemi / Fairchild; Manufacturer 1 Prt. Nr.: FSUSB42MUX
U40 = TLV62568ADRL_Step Down Converter 1A; 2A: Step Down Converter with Forced PWM in SOT563 Package; Manufacturer 1: Texas Instruments; Manufacturer 1 Prt. Nr.: TLV62568ADRL
U41 = AP22816AKCWT-7_Power Switch ICs - Power Distribution Load Switch: Power Switch ICs - Power Distribution Load Switch; Manufacturer 1: Diodes Incorporated; Manufacturer 1 Prt. Nr.: AP22816AKCWT-7

## Sheet Memory-QSPI_Flash-eMMC.SchDoc
size A3; SheetNumber: 22; SheetTotal: 32
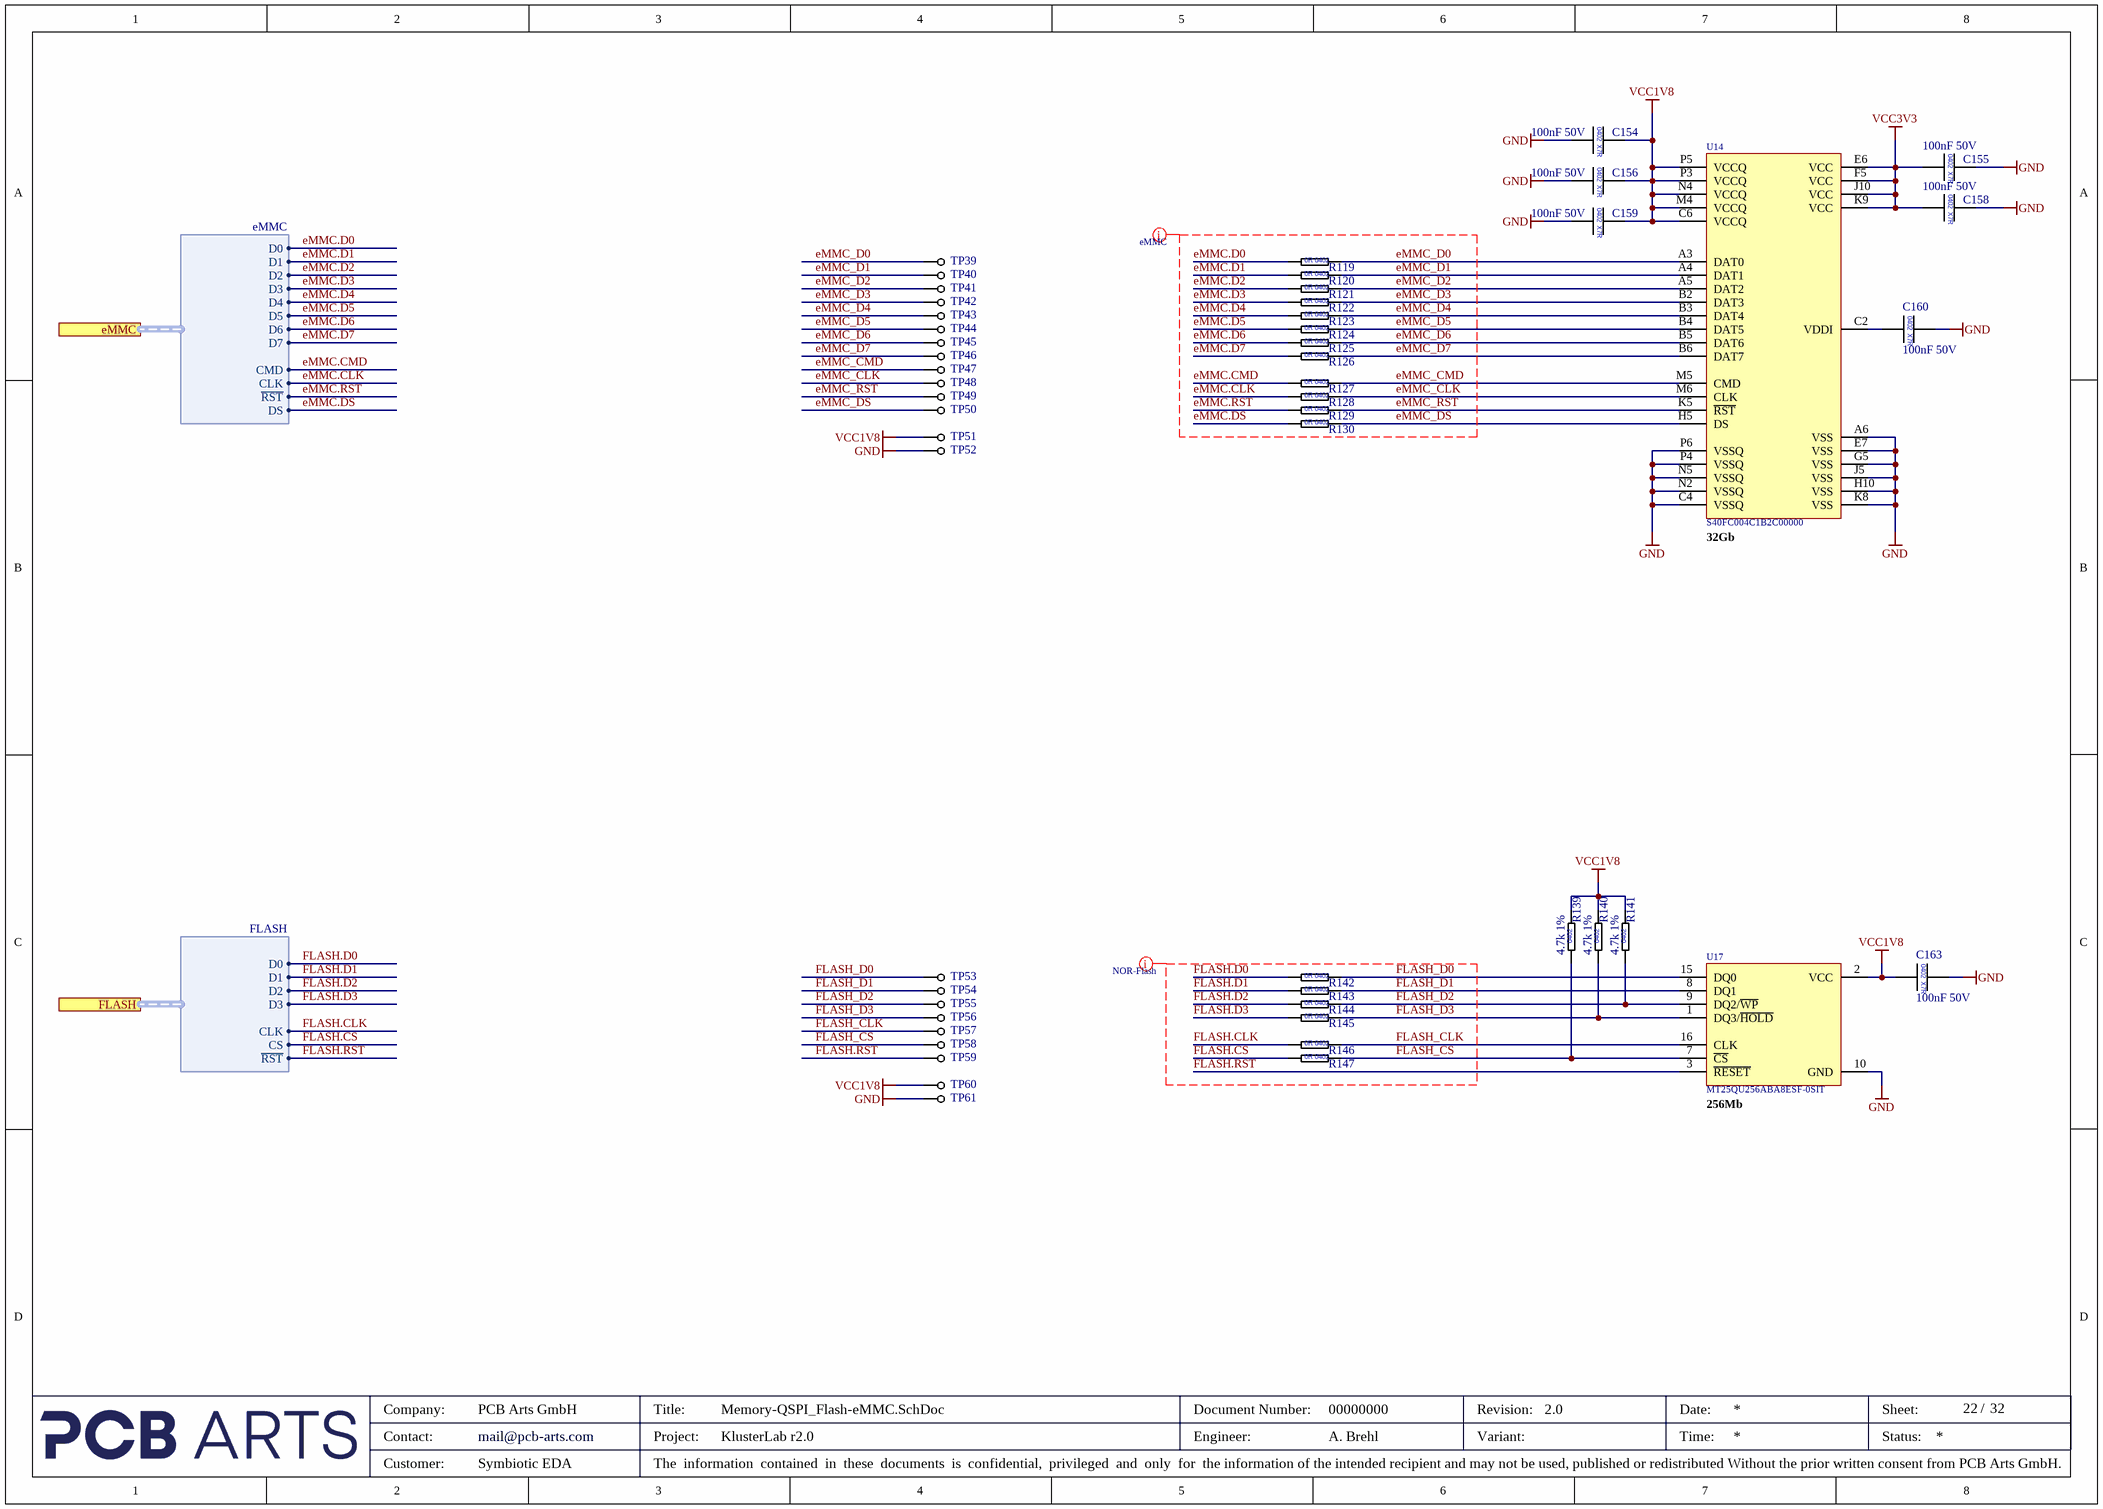
[diagram p30: Memory-QSPI_Flash-eMMC.SchDoc]

### Parts
C154  100nF 50V  [CAP_0402_L]
C155  100nF 50V  [CAP_0402_L]
C156  100nF 50V  [CAP_0402_L]
C158  100nF 50V  [CAP_0402_L]
C159  100nF 50V  [CAP_0402_L]
C160  100nF 50V  [CAP_0402_L]
C163  100nF 50V  [CAP_0402_L]
R119  0R Jumper  [RES_0402_L]  (value not drawn)
R120  0R Jumper  [RES_0402_L]  (value not drawn)
R121  0R Jumper  [RES_0402_L]  (value not drawn)
R122  0R Jumper  [RES_0402_L]  (value not drawn)
R123  0R Jumper  [RES_0402_L]  (value not drawn)
R124  0R Jumper  [RES_0402_L]  (value not drawn)
R125  0R Jumper  [RES_0402_L]  (value not drawn)
R126  0R Jumper  [RES_0402_L]  (value not drawn)
R127  0R Jumper  [RES_0402_L]  (value not drawn)
R128  0R Jumper  [RES_0402_L]  (value not drawn)
R129  0R Jumper  [RES_0402_L]  (value not drawn)
R130  0R Jumper  [RES_0402_L]  (value not drawn)
R139  4.7k 1%  [RES_0402_L]
R140  4.7k 1%  [RES_0402_L]
R141  4.7k 1%  [RES_0402_L]
R142  0R Jumper  [RES_0402_L]  (value not drawn)
R143  0R Jumper  [RES_0402_L]  (value not drawn)
R144  0R Jumper  [RES_0402_L]  (value not drawn)
R145  0R Jumper  [RES_0402_L]  (value not drawn)
R146  0R Jumper  [RES_0402_L]  (value not drawn)
R147  0R Jumper  [RES_0402_L]  (value not drawn)
TP39  Testpoint  [Testpoint 0.8mm]  (value not drawn)  (no BOM)
TP40  Testpoint  [Testpoint 0.8mm]  (value not drawn)  (no BOM)
TP41  Testpoint  [Testpoint 0.8mm]  (value not drawn)  (no BOM)
TP42  Testpoint  [Testpoint 0.8mm]  (value not drawn)  (no BOM)
TP43  Testpoint  [Testpoint 0.8mm]  (value not drawn)  (no BOM)
TP44  Testpoint  [Testpoint 0.8mm]  (value not drawn)  (no BOM)
TP45  Testpoint  [Testpoint 0.8mm]  (value not drawn)  (no BOM)
TP46  Testpoint  [Testpoint 0.8mm]  (value not drawn)  (no BOM)
TP47  Testpoint  [Testpoint 0.8mm]  (value not drawn)  (no BOM)
TP48  Testpoint  [Testpoint 0.8mm]  (value not drawn)  (no BOM)
TP49  Testpoint  [Testpoint 0.8mm]  (value not drawn)  (no BOM)
TP50  Testpoint  [Testpoint 0.8mm]  (value not drawn)  (no BOM)
TP51  Testpoint  [Testpoint 0.8mm]  (value not drawn)  (no BOM)
TP52  Testpoint  [Testpoint 0.8mm]  (value not drawn)  (no BOM)
TP53  Testpoint  [Testpoint 0.8mm]  (value not drawn)  (no BOM)
TP54  Testpoint  [Testpoint 0.8mm]  (value not drawn)  (no BOM)
TP55  Testpoint  [Testpoint 0.8mm]  (value not drawn)  (no BOM)
TP56  Testpoint  [Testpoint 0.8mm]  (value not drawn)  (no BOM)
TP57  Testpoint  [Testpoint 0.8mm]  (value not drawn)  (no BOM)
TP58  Testpoint  [Testpoint 0.8mm]  (value not drawn)  (no BOM)
TP59  Testpoint  [Testpoint 0.8mm]  (value not drawn)  (no BOM)
TP60  Testpoint  [Testpoint 0.8mm]  (value not drawn)  (no BOM)
TP61  Testpoint  [Testpoint 0.8mm]  (value not drawn)  (no BOM)
U14  S40FC004C1B2C00000  [BGA50P900X750X080-153N]
U17  MT25QU256ABA8ESF-0SIT  [SOIC16_Widebody]

### Ports
eMMC (harness eMMC, see Top-Level-Sheet[3B], Bank 0_Bank 14[8A]), FLASH (harness FLASH, see Top-Level-Sheet[3B], Bank 0_Bank 14[8C])

### Harnesses
FLASH: D0, D1, D2, D3, CLK, CS, ~{RST}
eMMC: D0, D1, D2, D3, CLK, CMD, ~{RST}, D4, D5, D6, D7, DS

### Nets
GND: C154.2 C155.1 C156.2 C158.1 C159.2 C160.1 C163.1 TP52.1(GND) TP61.1(GND) U14.A6(VSS) U14.C4(VSSQ) U14.E7(VSS) U14.G5(VSS) U14.H10(VSS) U14.J5(VSS) U14.K8(VSS) U14.N2(VSSQ) U14.N5(VSSQ) U14.P4(VSSQ) U14.P6(VSSQ) U17.10(GND)
VCC1V8: C154.1 C156.1 C159.1 C163.2 R139.2 R140.2 R141.2 TP51.1(GND) TP60.1(GND) U14.C6(VCCQ) U14.M4(VCCQ) U14.N4(VCCQ) U14.P3(VCCQ) U14.P5(VCCQ) U17.2(VCC)
VCC3V3: C155.2 C158.2 U14.E6(VCC) U14.F5(VCC) U14.J10(VCC) U14.K9(VCC)
eMMC.CLK: R128.1 ; port eMMC.CLK
eMMC.CMD: R127.1 ; port eMMC.CMD
eMMC.D0: R119.1 ; port eMMC.D0
eMMC.D1: R120.1 ; port eMMC.D1
eMMC.D2: R121.1 ; port eMMC.D2
eMMC.D3: R122.1 ; port eMMC.D3
eMMC.D4: R123.1 ; port eMMC.D4
eMMC.D5: R124.1 ; port eMMC.D5
eMMC.D6: R125.1 ; port eMMC.D6
eMMC.D7: R126.1 ; port eMMC.D7
eMMC.DS: R130.1 ; port eMMC.DS
eMMC.~{RST}: R129.1 ; port eMMC.~{RST}
eMMC_CLK: R128.2 TP48.1(GND) U14.M6(CLK)
eMMC_CMD: R127.2 TP47.1(GND) U14.M5(CMD)
eMMC_D0: R119.2 TP39.1(GND) U14.A3(DAT0)
eMMC_D1: R120.2 TP40.1(GND) U14.A4(DAT1)
eMMC_D2: R121.2 TP41.1(GND) U14.A5(DAT2)
eMMC_D3: R122.2 TP42.1(GND) U14.B2(DAT3)
eMMC_D4: R123.2 TP43.1(GND) U14.B3(DAT4)
eMMC_D5: R124.2 TP44.1(GND) U14.B4(DAT5)
eMMC_D6: R125.2 TP45.1(GND) U14.B5(DAT6)
eMMC_D7: R126.2 TP46.1(GND) U14.B6(DAT7)
eMMC_DS: R130.2 TP50.1(GND) U14.H5(DS)
eMMC_~{RST}: R129.2 TP49.1(GND) U14.K5(~{RST})
FLASH.~{CS}: R147.1 ; port FLASH.CS
FLASH.CLK: R146.1 ; port FLASH.CLK
FLASH.D0: R142.1 ; port FLASH.D0
FLASH.D1: R143.1 ; port FLASH.D1
FLASH.D2: R144.1 ; port FLASH.D2
FLASH.D3: R145.1 ; port FLASH.D3
FLASH.~{RST}: TP59.1(GND) U17.3(~{RESET}) ; port FLASH.~{RST}
FLASH_~{CS}: R139.1 R147.2 TP58.1(GND) U17.7(~{CS})
FLASH_CLK: R146.2 TP57.1(GND) U17.16(CLK)
FLASH_D0: R142.2 TP53.1(GND) U17.15(DQ0)
FLASH_D1: R143.2 TP54.1(GND) U17.8(DQ1)
FLASH_D2: R141.1 R144.2 TP55.1(GND) U17.9(DQ2/~{WP})
FLASH_D3: R140.1 R145.2 TP56.1(GND) U17.1(DQ3/~{HOLD})
NetC160_2: C160.2 U14.C2(VDDI)

### Layout directives
net class eMMC: eMMC.CLK, eMMC.CMD, eMMC.D0, eMMC.D1, eMMC.D2, eMMC.D3, eMMC.D4, eMMC.D5, eMMC.D6, eMMC.D7, eMMC.DS, eMMC.~{RST}, eMMC_CLK, eMMC_CMD, eMMC_D0, eMMC_D1, eMMC_D2, eMMC_D3, eMMC_D4, eMMC_D5, eMMC_D6, eMMC_D7, eMMC_DS, eMMC_~{RST}
net class NOR-Flash: FLASH.CLK, FLASH.D0, FLASH.D1, FLASH.D2, FLASH.D3, FLASH.~{CS}, FLASH.~{RST}, FLASH_CLK, FLASH_D0, FLASH_D1, FLASH_D2, FLASH_D3, FLASH_~{CS}

### Notes on the sheet
- (near U14) 32Gb
- (near U17) 256Mb
- Company:
- Contact:
- Customer:
- mail@pcb-arts.com
- PCB Arts GmbH
- Title:
- Project:
- The  information  contained  in  these  documents  is  confidential,  privileged  and  only  for  the information of the intended recipient and may not be used, published or redistributed Without the prior written consent from PCB Arts GmbH.
- Engineer:
- Document Number:
- Revision:
- Variant:
- Date:
- Time:
- Sheet:
- Status:
- /
- (in symbol CAP_0402_100nF_50V) 0402; X7R
- (in symbol RES_0402_0R Jumper) 0R 0402
- (in symbol RES_0402_4.7k_1%) 0402

### Library data of the parts
C154-C156 C158-C160 C163 = CAP_0402_100nF_50V: as C289 on sheet PSU_VCC5V_Buck; Manufacturer 2: TDK
R119-R130 R142-R147 = RES_0402_0R Jumper: as R213 on sheet PSU_VCC5V_Buck; Manufacturer 2: Yageo
R139-R141 = RES_0402_4.7k_1%: Thick Film Resistors - SMD 4.7kOhm 1%; Manufacturer 1: Vishay / Dale; Manufacturer 1 Prt. Nr.: CRCW04024K70FKEDC; Manufacturer 2 Prt. Nr.: RC0402FR-134K7L; Manufacturer 2: Yageo
TP39-TP61 = Testpoint 0.8mm
U14 = S40FC004C1B2C00000_eMMC 4GB e.MMC5.1 BGA 9.0 x 7.5 x 0.8 mm: eMMC 4GB e.MMC5.1 BGA 9.0 x 7.5 x 0.8 mm; Manufacturer 1: SkyHigh Memory; Manufacturer 1 Prt. Nr.: S40FC004C1B2C00000
U17 = MT25QU256ABA8ESF-0SIT_NOR-Flash SPI 256Mbit NOR-Flash /1.8V: NOR-Flash SPI 256Mbit NOR-Flash /1.8V; Manufacturer 1: Micron; Manufacturer 1 Prt. Nr.: MT25QU256ABA8ESF-0SIT